# Altium project PLWD_Schematic.PrjPcb (part 1 of 2)
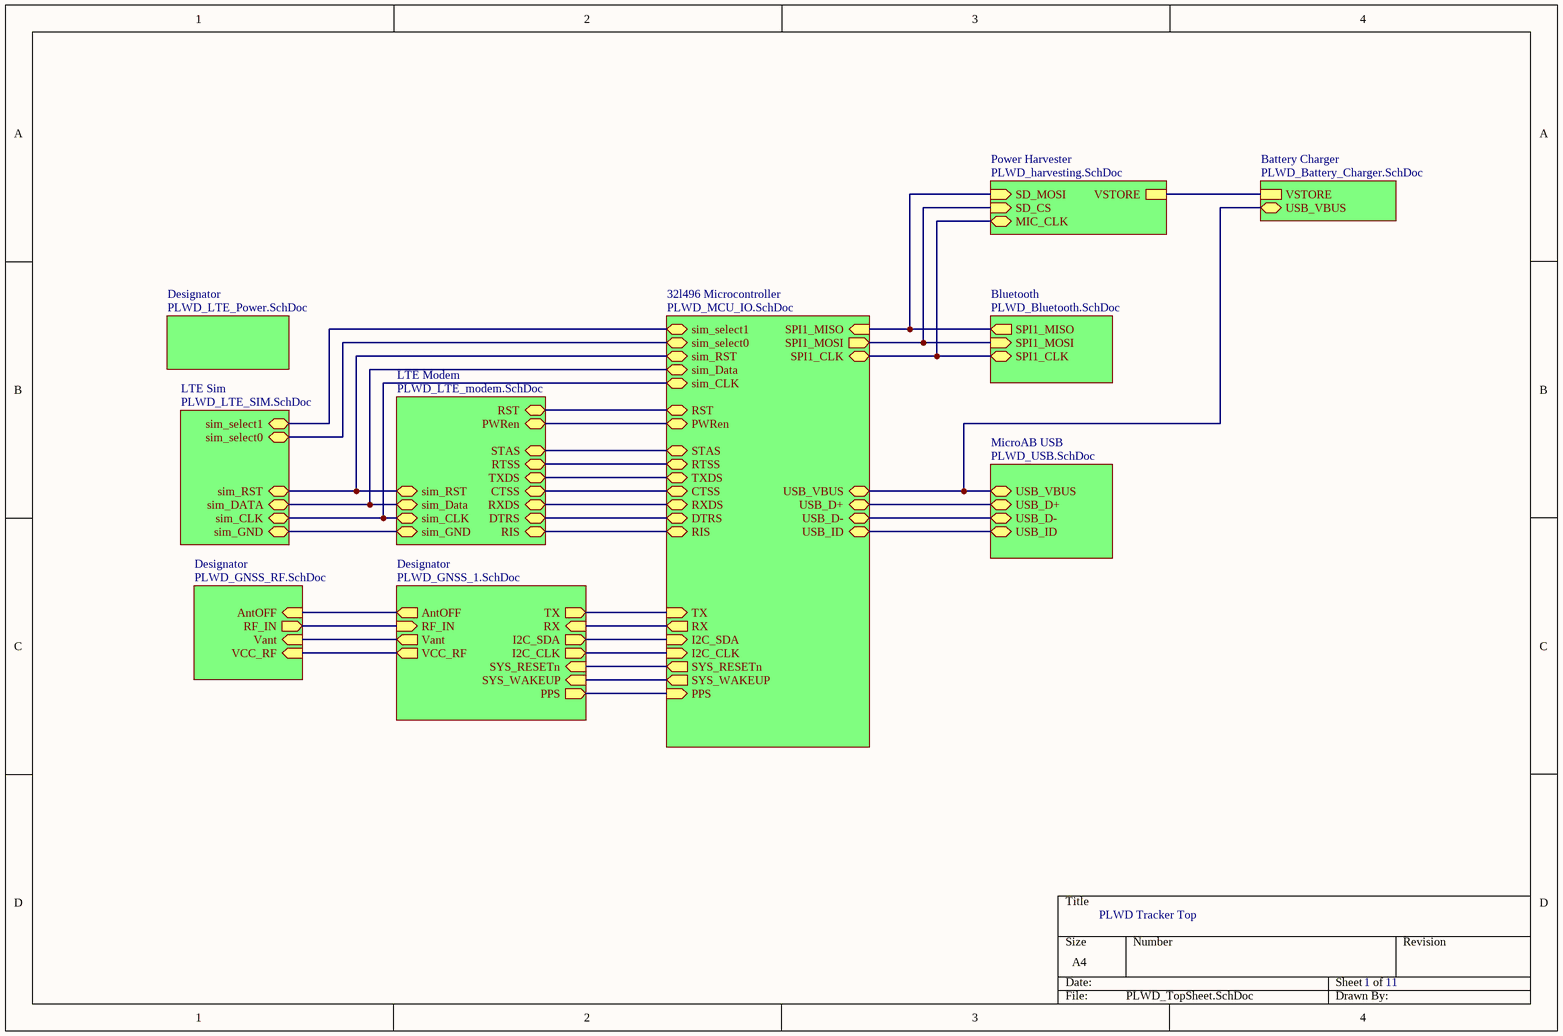
[diagram p0: PLWD_TopSheet.SchDoc]
11 sheets, 186 parts. Net scope: hierarchical (ports join the sheet entries above them; power ports are global).
Sheets:
  PLWD_TopSheet.SchDoc
    32l496 Microcontroller = PLWD_MCU_IO.SchDoc
    Bluetooth = PLWD_Bluetooth.SchDoc
    Designator = PLWD_GNSS_RF.SchDoc
    MicroAB USB = PLWD_USB.SchDoc
    Power Harvester = PLWD_harvesting.SchDoc
    Designator = PLWD_GNSS_1.SchDoc
    Battery Charger = PLWD_Battery_Charger.SchDoc
    LTE Modem = PLWD_LTE_modem.SchDoc
    Designator = PLWD_LTE_Power.SchDoc
    LTE Sim = PLWD_LTE_SIM.SchDoc

## Sheet PLWD_TopSheet.SchDoc
size A4; SheetNumber: 1; SheetTotal: 11

### Sub-sheets
32l496 Microcontroller = PLWD_MCU_IO.SchDoc: SPI1_MISO (in), SPI1_MOSI (out), USB_VBUS (bidir), USB_D+ (bidir), USB_D- (bidir), USB_ID (bidir), STAS (bidir), RTSS (bidir), TXDS (bidir), CTSS (bidir), RXDS (bidir), DTRS (bidir), RIS (bidir), PWRen (bidir), RST (bidir), sim_CLK (bidir), sim_Data (bidir), sim_RST (bidir), sim_select1 (bidir), sim_select0 (bidir), TX (in), RX (out), I2C_SDA (in), I2C_CLK (in), SYS_WAKEUP (out), PPS (in), SYS_RESETn (out), SPI1_CLK (bidir)
Battery Charger = PLWD_Battery_Charger.SchDoc: VSTORE, USB_VBUS (bidir)
Bluetooth = PLWD_Bluetooth.SchDoc: SPI1_MISO (out), SPI1_MOSI (in), SPI1_CLK (bidir)
Designator = PLWD_GNSS_RF.SchDoc: AntOFF (in), RF_IN (out), Vant (in), VCC_RF (in)
Designator = PLWD_GNSS_1.SchDoc: TX (out), RX (in), I2C_SDA (out), SYS_RESETn (in), I2C_CLK (out), SYS_WAKEUP (in), PPS (out), AntOFF (out), RF_IN (in), Vant (out), VCC_RF (out)
Designator = PLWD_LTE_Power.SchDoc: no entries
LTE Modem = PLWD_LTE_modem.SchDoc: sim_GND (bidir), sim_CLK (bidir), sim_Data (bidir), sim_RST (bidir), PWRen (bidir), RST (bidir), RIS (bidir), DTRS (bidir), RXDS (bidir), CTSS (bidir), TXDS (bidir), RTSS (bidir), STAS (bidir)
LTE Sim = PLWD_LTE_SIM.SchDoc: sim_GND (bidir), sim_DATA (bidir), sim_RST (bidir), sim_select0 (bidir), sim_CLK (bidir), sim_select1 (bidir)
MicroAB USB = PLWD_USB.SchDoc: USB_VBUS (bidir), USB_D+ (bidir), USB_D- (bidir), USB_ID (bidir)
Power Harvester = PLWD_harvesting.SchDoc: MIC_CLK (bidir), SD_MOSI (in), SD_CS (in), VSTORE

### Nets
Ant_In: sheet Designator/RF_IN, sheet Designator/RF_IN
AntOFF: sheet Designator/AntOFF, sheet Designator/AntOFF
CTSS: sheet 32l496 Microcontroller/CTSS, sheet LTE Modem/CTSS
DTRS: sheet 32l496 Microcontroller/DTRS, sheet LTE Modem/DTRS
PA6: sheet 32l496 Microcontroller/SPI1_MISO, sheet Bluetooth/SPI1_MISO, sheet Power Harvester/SD_MOSI
PA7: sheet 32l496 Microcontroller/SPI1_MOSI, sheet Bluetooth/SPI1_MOSI, sheet Power Harvester/SD_CS
PA9: sheet 32l496 Microcontroller/USB_VBUS, sheet MicroAB USB/USB_VBUS, sheet Battery Charger/USB_VBUS
PA10: sheet 32l496 Microcontroller/USB_D+, sheet MicroAB USB/USB_D+
PA11: sheet 32l496 Microcontroller/USB_D-, sheet MicroAB USB/USB_D-
PA12: sheet 32l496 Microcontroller/USB_ID, sheet MicroAB USB/USB_ID
PPS: sheet 32l496 Microcontroller/PPS, sheet Designator/PPS
PWRen: sheet 32l496 Microcontroller/PWRen, sheet LTE Modem/PWRen
RIS: sheet 32l496 Microcontroller/RIS, sheet LTE Modem/RIS
RST: sheet 32l496 Microcontroller/RST, sheet 32l496 Microcontroller/sim_RST, sheet LTE Modem/sim_RST, sheet LTE Modem/RST, sheet LTE Sim/sim_RST
RTSS: sheet 32l496 Microcontroller/RTSS, sheet LTE Modem/RTSS
RXDS: sheet 32l496 Microcontroller/RXDS, sheet LTE Modem/RXDS
sim_CLK: sheet 32l496 Microcontroller/sim_CLK, sheet LTE Modem/sim_CLK, sheet LTE Sim/sim_CLK
sim_Data: sheet 32l496 Microcontroller/sim_Data, sheet LTE Modem/sim_Data, sheet LTE Sim/sim_DATA
sim_GND: sheet LTE Modem/sim_GND, sheet LTE Sim/sim_GND
STAS: sheet 32l496 Microcontroller/STAS, sheet LTE Modem/STAS
SYS_RESETn: sheet 32l496 Microcontroller/SYS_RESETn, sheet Designator/SYS_RESETn
SYS_WAKEUP: sheet 32l496 Microcontroller/SYS_WAKEUP, sheet Designator/SYS_WAKEUP
TX: sheet 32l496 Microcontroller/TX, sheet Designator/TX
TXDS: sheet 32l496 Microcontroller/TXDS, sheet LTE Modem/TXDS
Vant: sheet Designator/Vant, sheet Designator/Vant
VCC_RF: sheet Designator/VCC_RF, sheet Designator/VCC_RF
NetR8_2: sheet 32l496 Microcontroller/SPI1_CLK, sheet Bluetooth/SPI1_CLK, sheet Power Harvester/MIC_CLK
NetR27_2: sheet 32l496 Microcontroller/sim_select1, sheet LTE Sim/sim_select1
NetR42_1: sheet Power Harvester/VSTORE, sheet Battery Charger/VSTORE
NetU1_36: sheet 32l496 Microcontroller/RX, sheet Designator/RX
NetU1_74: sheet 32l496 Microcontroller/sim_select0, sheet LTE Sim/sim_select0
NetU1_139: sheet 32l496 Microcontroller/I2C_CLK, sheet Designator/I2C_CLK
NetU1_140: sheet 32l496 Microcontroller/I2C_SDA, sheet Designator/I2C_SDA

### Notes on the sheet
- PLWD Tracker Top
- 1
- 11

## Sheet PLWD_MCU_IO.SchDoc
size A3; SheetNumber: 3; SheetTotal: 11
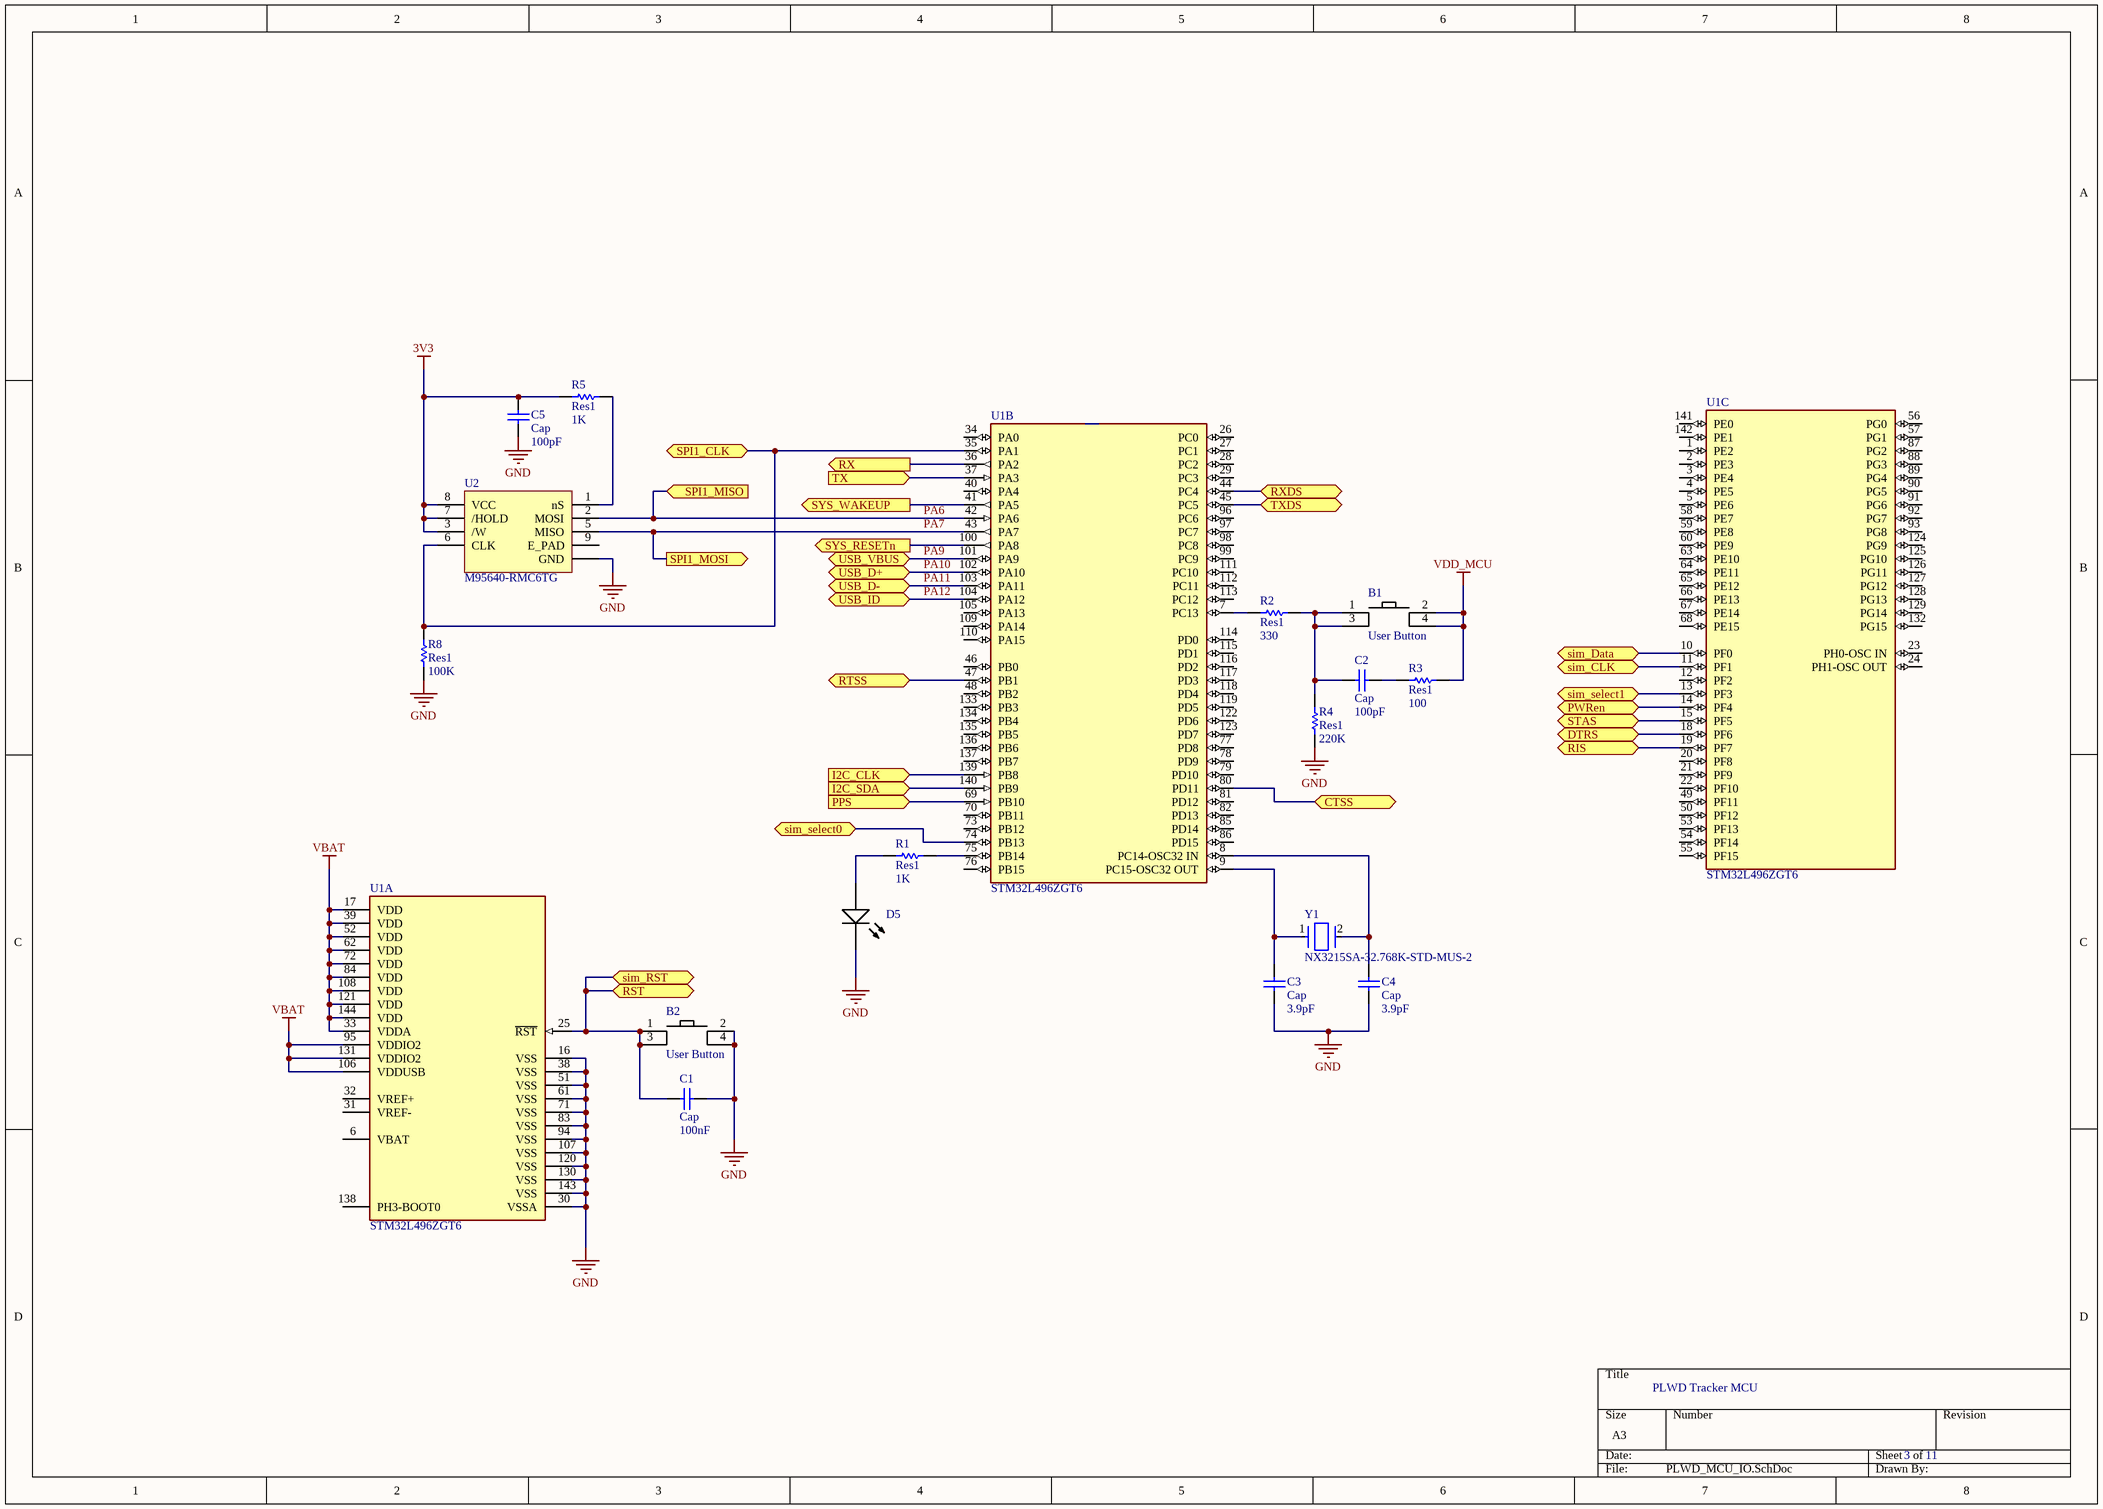
[diagram p1: PLWD_MCU_IO.SchDoc]

### Parts
B1  User Button
B2  User Button
C1  Cap  value 100nF  [RAD-0.3]
C2  Cap  value 100pF  [RAD-0.3]
C3  Cap  value 3.9pF  [RAD-0.3]
C4  Cap  value 3.9pF  [RAD-0.3]
C5  Cap  value 100pF  [RAD-0.3]
D5  16-219A/T2D-AR2T1QY/3T  [EVRL-0402-2_V]  (value not drawn)
R1  Res1  value 1K  [AXIAL-0.3]
R2  Res1  value 330  [AXIAL-0.3]
R3  Res1  value 100  [AXIAL-0.3]
R4  Res1  value 220K  [AXIAL-0.3]
R5  Res1  value 1K  [AXIAL-0.3]
R8  Res1  value 100K  [AXIAL-0.3]
U1  STM32L496ZGT6  [FP-LQFP144-1A-MFG]  (parts A,B,C of 3)
U2  M95640-RMC6TG
Y1  NX3215SA-32.768K-STD-MUS-2  [FP-NX3215SA-MFG]

### Ports
CTSS (bidir), DTRS (bidir), I2C_CLK (in), I2C_SDA (in), PPS (in), PWRen (bidir), RIS (bidir), RST (bidir), RTSS (bidir), RX (out), RXDS (bidir), sim_CLK (bidir), sim_Data (bidir), sim_RST (bidir), sim_select0 (bidir), sim_select1 (bidir), SPI1_CLK (bidir), SPI1_MISO (in), SPI1_MOSI (out), STAS (bidir), SYS_RESETn (out), SYS_WAKEUP (out), TX (in), TXDS (bidir), USB_D+ (bidir), USB_D- (bidir), USB_ID (bidir), USB_VBUS (bidir)

### Nets
3V3: C5.2 R5.1 U2.3(/W) U2.7(/HOLD) U2.8(VCC)
GND: B2.2 B2.4 C1.2 C3.1 C4.1 C5.1 D5.2(K) R4.1 R8.1 U1.16(VSS) U1.30(VSSA) U1.38(VSS) U1.51(VSS) U1.61(VSS) U1.71(VSS) U1.83(VSS) U1.94(VSS) U1.107(VSS) U1.120(VSS) U1.130(VSS) U1.143(VSS) U2.4(GND)
VBAT: U1.17(VDD) U1.33(VDDA) U1.39(VDD) U1.52(VDD) U1.62(VDD) U1.72(VDD) U1.84(VDD) U1.95(VDDIO2) U1.106(VDDUSB) U1.108(VDD) U1.121(VDD) U1.131(VDDIO2) U1.144(VDD)
VDD_MCU: B1.2 B1.4 R3.2
CTSS: U1.80(PD11) ; port CTSS
DTRS: U1.18(PF6) ; port DTRS
PA6: U1.42(PA6) U2.2(MOSI) ; port SPI1_MISO
PA7: U1.43(PA7) U2.5(MISO) ; port SPI1_MOSI
PA9: U1.101(PA9) ; port USB_VBUS
PA10: U1.102(PA10) ; port USB_D+
PA11: U1.103(PA11) ; port USB_D-
PA12: U1.104(PA12) ; port USB_ID
PPS: U1.69(PB10) ; port PPS
PWRen: U1.14(PF4) ; port PWRen
RIS: U1.19(PF7) ; port RIS
RST: B2.1 B2.3 C1.1 U1.25(~{RST}) ; port sim_RST, port RST
RTSS: U1.47(PB1) ; port RTSS
RXDS: U1.44(PC4) ; port RXDS
sim_CLK: U1.11(PF1) ; port sim_CLK
sim_Data: U1.10(PF0) ; port sim_Data
STAS: U1.15(PF5) ; port STAS
SYS_RESETn: U1.100(PA8) ; port SYS_RESETn
SYS_WAKEUP: U1.41(PA5) ; port SYS_WAKEUP
TX: U1.37(PA3) ; port TX
TXDS: U1.45(PC5) ; port TXDS
NetB1_1: B1.1 B1.3 C2.1 R2.2 R4.2
NetC2_2: C2.2 R3.1
NetC3_2: C3.2 U1.9(PC15-OSC32_OUT) Y1.1
NetC4_2: C4.2 U1.8(PC14-OSC32_IN) Y1.2
NetD5_1: D5.1(A) R1.1
NetR1_2: R1.2 U1.75(PB14)
NetR2_1: R2.1 U1.7(PC13)
NetR5_2: R5.2 U2.1(nS)
NetR8_2: R8.2 U1.35(PA1) U2.6(CLK) ; port SPI1_CLK
NetR27_2: U1.13(PF3) ; port sim_select1
NetU1_36: U1.36(PA2) ; port RX
NetU1_74: U1.74(PB13) ; port sim_select0
NetU1_139: U1.139(PB8) ; port I2C_CLK
NetU1_140: U1.140(PB9) ; port I2C_SDA

Not connected (* = marked no-connect by the designer): U1 1(PE2) 2(PE3) 3(PE4) 4(PE5) 5(PE6) 6(VBAT) 12(PF2) 20(PF8) 21(PF9) 22(PF10) 23(PH0-OSC_IN) 24(PH1-OSC_OUT) 26(PC0) 27(PC1) 28(PC2) 29(PC3) 31(VREF-) 32(VREF+) 34(PA0) 40(PA4) 46(PB0) 48(PB2) 49(PF11) 50(PF12) 53(PF13) 54(PF14) 55(PF15) 56(PG0) 57(PG1) 58(PE7) 59(PE8) 60(PE9) 63(PE10) 64(PE11) 65(PE12) 66(PE13) 67(PE14) 68(PE15) 70(PB11) 73(PB12) 76(PB15) 77(PD8) 78(PD9) 79(PD10) 81(PD12) 82(PD13) 85(PD14) 86(PD15) 87(PG2) 88(PG3) 89(PG4) 90(PG5) 91(PG6) 92(PG7) 93(PG8) 96(PC6) 97(PC7) 98(PC8) 99(PC9) 105(PA13) 109(PA14) 110(PA15) 111(PC10) 112(PC11) 113(PC12) 114(PD0) 115(PD1) 116(PD2) 117(PD3) 118(PD4) 119(PD5) 122(PD6) 123(PD7) 124(PG9) 125(PG10) 126(PG11) 127(PG12) 128(PG13) 129(PG14) 132(PG15) 133(PB3) 134(PB4) 135(PB5) 136(PB6) 137(PB7) 138(PH3-BOOT0) 141(PE0) 142(PE1); U2 9(E_PAD)

### Notes on the sheet
- PLWD Tracker MCU
- 3
- 11

### Library data of the parts
B1 B2 = button
C1-C5 = Cap: Capacitor; Published: 8-Jun-2000; LatestRevisionDate: 17-Jul-2002; LatestRevisionNote: Re-released for DXP Platform.; PackageReference: RAD-0.3; Publisher: Altium Limited; PackageDescription: Radial Cap, Thru-Hole; 2 Leads; 0.3 in Pin Spacing
D5 = CMP-007-00000-2: Chip LED, White, 5 V, 10 mA, 30 mW, -40 to 85 degC, 2-Pin SMD (0402), RoHS, Tape and Reel; Manufacturer: Everlight Electronics; Luminous Intensity: 360mcd; Forward Voltage: 2.6V; Viewing Angle: 130degrees; Power: 30mW; Forward Current: 5mA; Package Quantity: 3000; Max Operating Temperature: 85°C; Datasheet Version: Rev. 5, 04/2013; Datasheet URL: http://www.everlight.com/file/ProductFile/16-219A-T2D-AR2T1QY-3T.pdf; Package Reference: 0402; Mounting Technology: SM; Case/Package: 0402; Illumination Colour: White; Manufacturer URL: http://www.everlight.com/; Package Description: 2-Pin Surface Mount Device, Body 1 x 0.5 mm; RoHS Compliant: True; Packaging: TapeandReel; Min Operating Temperature: -40°C
R1-R5 R8 = Res1: Resistor; Published: 8-Jun-2000; LatestRevisionDate: 17-Jul-2002; LatestRevisionNote: Re-released for DXP Platform.; PackageReference: AXIAL-0.3; Publisher: Altium Limited; PackageDescription: Axial Device, Thru-Hole; 2 Leads; 0.3 in Pin Spacing
U1 = CMP-12105-000038-1: IC MCU 32BIT 1MB FLASH 144LQFP; Manufacturer: STMicroelectronics; Max Supply Voltage: 3.6V; Core Architecture: ARM Cortex-M4; Data Bus Width: 32bits; Number Of I2C Channels: 4; Standoff Height: 0.05mm; Max Junction Temp: +105°C; Number Of I/Os: 115; Number Of Pwm Channels: 28; Number Of Spi Channels: 3; Min Supply Voltage: 1.05V; Number Of Adc Channels: 24; Interface: I2C,SPI,UART,USART,CAN,USB,LIN,IrDA,I2S,Other; Number Of Timers/Counters: 13; Ram Size: 320KBytes; Frequency: 80MHz; Number Of Usb Channels: 1; Number Of Uart Channels: 6; Memory Size: 1MBytes; Temperature: -40°C to +105°C; Category: IC; ComponentLink2URL: https://www.st.com/resource/en/datasheet/stm32l496zg.pdf; Device Class L2: Embedded Processors and Controllers; Automotive: No; Device Class L3: Microcontrollers; Digikey Description: IC MCU 32BIT 1MB FLASH 144LQFP; Device Class L1: Integrated Circuits (ICs); Ambient Temperature Range High: +85°C; Ambient Temperature Range Low: -40°C; Temperature Range Low: -40°C; ComponentLink2Description: Datasheet; Package: LQFP144-1A; Manufacturer Part Number: STM32L496ZGT6; Octopart: https://octopart.com/stm32l496zgt6-stmicroelectronics-80927210; Number Of Cores: 1; Height: 1.6mm; Memory Type: FLASH; Lead Free: Yes; Temperature Range High: +105°C; RoHS: TRUE; Number Of A/D Converters: 3; Ipc Land Pattern Name: QFP50P2200X2200X160-144
U2 = M95640-RMC6TG: M95640 Series 64 Kb (8K x 8) 5.5 V 20 MHz SMT Serial SPI bus EEPROM - UFDFPN-8; Manufacturer: STMicroelectronics; Density: 64Kb; Frequency: 20MHz; Interface: SPI,Serial,3-WIRE; Max Supply Voltage: 5.5V; Min Supply Voltage: 1.8V; Nominal Supply Current: 5mA; Access Time: 20ns; Organization: 8KX8; Write Protection: YES; Supplier 1: Digi-Key; Manufacturer Part Number: M95640-RMC6TG; RoHS: Yes; Category: EEPROM; Pricing 1: 1=0.54000, 10=0.53100, 25=0.49240, 50=0.49000, 100=0.43510, 250=0.42956, 500=0.42306, 1000=0.41176 (USD); Mount: Surface Mount; Number of Pins: 8; Min Operating Temperature: -40°C; Max Operating Temperature: 85°C; Packaging: Tape and Reel; Memory Type: EEPROM; Package Quantity: 5000; Access Time-Max: 20ns; Supply Current: 5mA; Max Frequency: 20MHz; Series: -; Programming Voltage: 5.5V; Radiation Hardening: No; RoHS Compliant: Yes; Lead Free: Lead Free; ComponentLink1URL: https://datasheet.ciiva.com/1912/cd00258834-1912079.pdf?src-supplier=Digi-Key; ComponentLink1Description: https://datasheet.ciiva.com/1912/cd00258834-1912079.pdf?src-supplier=Digi-Key; ComponentLink2URL: https://datasheet.ciiva.com/26910/getdatasheetpartid-755070-26910586.pdf?src-supplier=Verical; ComponentLink2Description: https://datasheet.ciiva.com/26910/getdatasheetpartid-755070-26910586.pdf?src-supplier=Verical; ComponentLink3URL: https://datasheet.ciiva.com/16622/cd00258834-16622988.pdf?src-supplier=Avnet+Europe; ComponentLink3Description: https://datasheet.ciiva.com/16622/cd00258834-16622988.pdf?src-supplier=Avnet+Europe; Supplier Part Number 1: 497-15780-1-ND
Y1 = CMP-200220-000010-1: CRYSTAL 32.7680KHZ 12.5PF SMD; Frequency Tolerance: 20ppm; ESR (Equivalent Series Resistance): 70kR; Frequency: 32.768kHz; Length: 0.126inch; Number of Pins: 2; Max Operating Temperature: 125°C; Width: 0.059inch; Load Capacitance: 12.5pF; Case/Package: SMD/SMT; Height: 0.035inch; Packaging: Tape and Reel; Mount: Surface Mount; Package Quantity: 1000; Min Operating Temperature: -40°C

## Sheet PLWD_Bluetooth.SchDoc
size A4; SheetNumber: 2; SheetTotal: 11
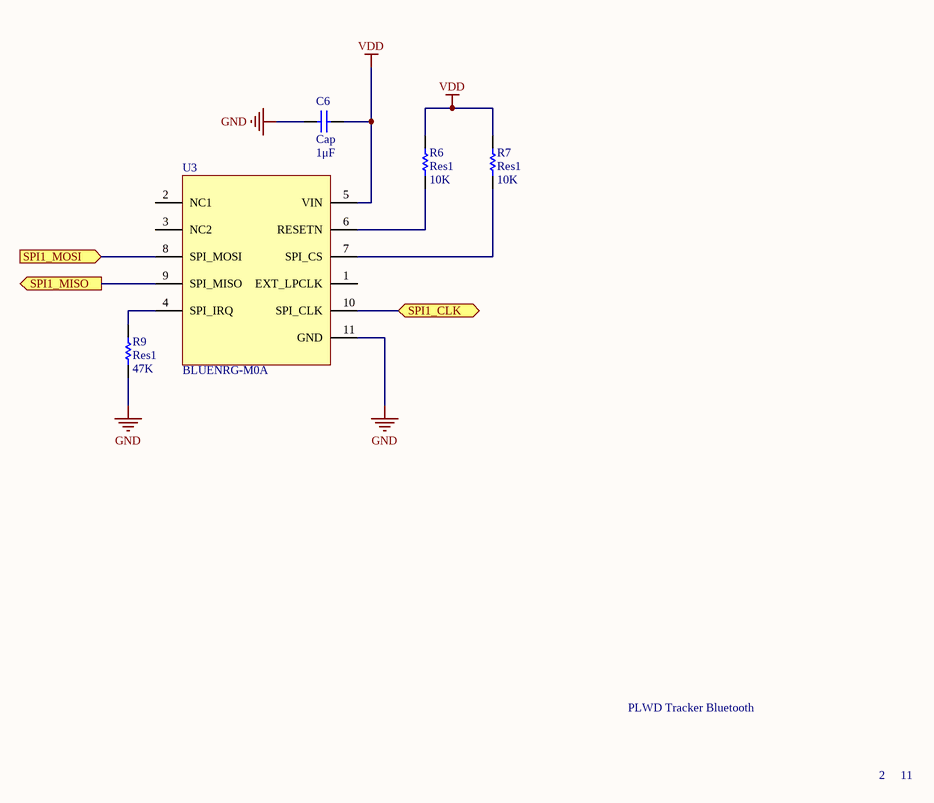
[diagram p2: PLWD_Bluetooth.SchDoc]

### Parts
C6  Cap  value 1μF  [RAD-0.3]
R6  Res1  value 10K  [AXIAL-0.3]
R7  Res1  value 10K  [AXIAL-0.3]
R9  Res1  value 47K  [AXIAL-0.3]
U3  BLUENRG-M0A

### Ports
SPI1_CLK (bidir), SPI1_MISO (out), SPI1_MOSI (in)

### Nets
GND: C6.1 R9.1 U3.11(GND)
VDD: C6.2 R6.2 R7.2 U3.5(VIN)
PA6: U3.9(SPI_MISO) ; port SPI1_MISO
PA7: U3.8(SPI_MOSI) ; port SPI1_MOSI
NetR6_1: R6.1 U3.6(RESETN)
NetR7_1: R7.1 U3.7(SPI_CS)
NetR8_2: U3.10(SPI_CLK) ; port SPI1_CLK
NetR9_2: R9.2 U3.4(SPI_IRQ)

Not connected (* = marked no-connect by the designer): U3 1(EXT_LPCLK) 2(NC1) 3(NC2)

### Notes on the sheet
- PLWD Tracker Bluetooth
- 2
- 11

### Library data of the parts
C6 = Cap: Capacitor; Published: 8-Jun-2000; LatestRevisionDate: 17-Jul-2002; LatestRevisionNote: Re-released for DXP Platform.; PackageReference: RAD-0.3; Publisher: Altium Limited; PackageDescription: Radial Cap, Thru-Hole; 2 Leads; 0.3 in Pin Spacing
R6 R7 R9 = Res1: Resistor; Published: 8-Jun-2000; LatestRevisionDate: 17-Jul-2002; LatestRevisionNote: Re-released for DXP Platform.; PackageReference: AXIAL-0.3; Publisher: Altium Limited; PackageDescription: Axial Device, Thru-Hole; 2 Leads; 0.3 in Pin Spacing
U3 = BLUENRG-M0A: Very low power network processor module for Bluetooth® low energy v4.2; Manufacturer: STMicroelectronics; Supplier 1: Digi-Key; Manufacturer Part Number: BLUENRG-M0A; RoHS: Yes; Category: RF Receivers, Transceivers; Pricing 1: 1=12.60000, 10=11.54700, 25=10.49720, 100=9.44740, 250=8.66008, 500=8.34996 (USD); RoHS Compliant: Yes; Supplier Part Number 1: 497-BLUENRG-M0ACT-ND

## Sheet PLWD_GNSS_RF.SchDoc
size A3; SheetNumber: 4; SheetTotal: 11
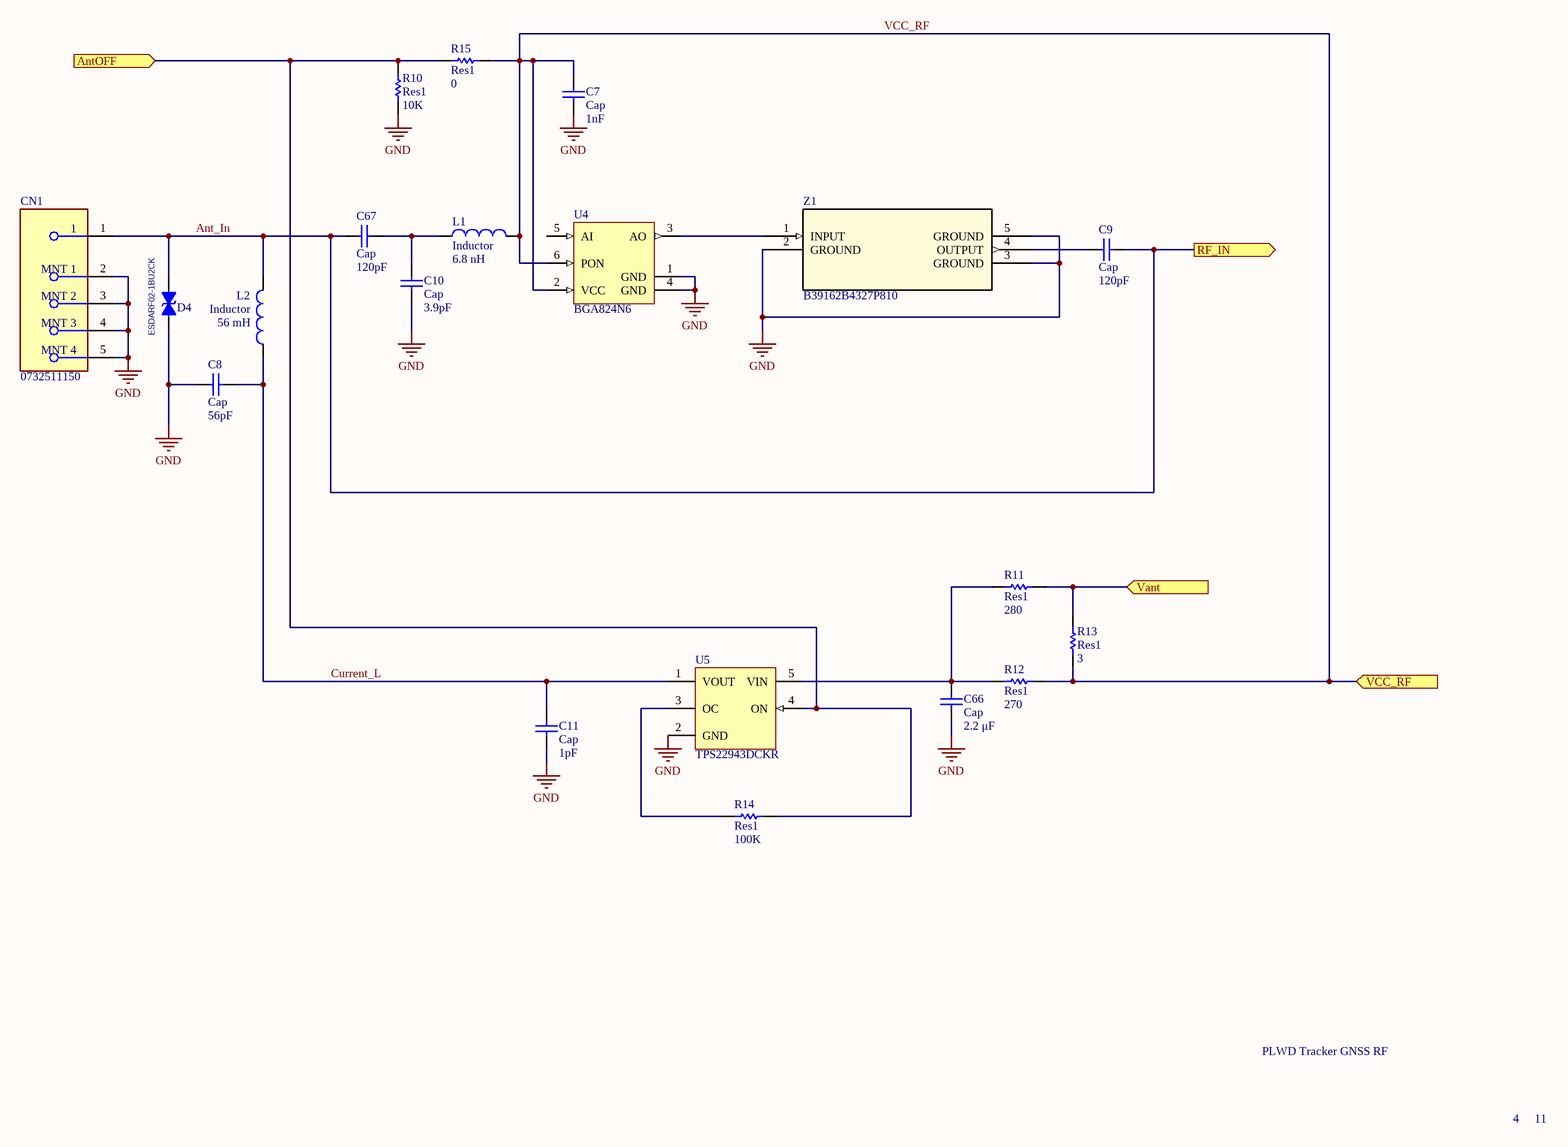
[diagram p3: PLWD_GNSS_RF.SchDoc]

### Parts
C7  Cap  value 1nF  [RAD-0.3]
C8  Cap  value 56pF  [RAD-0.3]
C9  Cap  value 120pF  [RAD-0.3]
C10  Cap  value 3.9pF  [RAD-0.3]
C11  Cap  value 1pF  [RAD-0.3]
C66  Cap  value 2.2 μF  [RAD-0.3]
C67  Cap  value 120pF  [RAD-0.3]
CN1  0732511150  [FP-0732511150-MFG]
D4  ESDARF02-1BU2CK  [ST_0201B]
L1  Inductor  value 6.8 nH  [0402-A]
L2  Inductor  value 56 mH  [0402-A]
R10  Res1  value 10K  [AXIAL-0.3]
R11  Res1  value 280  [AXIAL-0.3]
R12  Res1  value 270  [AXIAL-0.3]
R13  Res1  value 3  [AXIAL-0.3]
R14  Res1  value 100K  [AXIAL-0.3]
R15  Res1  value 0  [AXIAL-0.3]
U4  BGA824N6  [INF-TSNP-6-2_V]
U5  TPS22943DCKR  [DCK0005A_N]
Z1  B39162B4327P810  [B39162B4327P810_TDK]

### Ports
AntOFF (in), RF_IN (out), Vant (in), VCC_RF (in)

### Nets
GND: C7.1 C8.1 C10.1 C11.1 C66.1 CN1.2(MNT_1) CN1.3(MNT_2) CN1.4(MNT_3) CN1.5(MNT_4) D4.1 R10.1 U4.1(GND) U4.4(GND) U5.2(GND) Z1.2(GROUND) Z1.3(GROUND) Z1.5(GROUND)
Ant_In: C9.2 C67.1 CN1.1 D4.2 L2.2 ; port RF_IN
AntOFF: R10.2 R14.2 R15.1 U5.4(ON) ; port AntOFF
Current_L: C8.2 C11.2 L2.1 U5.1(VOUT)
Vant: R11.2 R13.2 ; port Vant
VCC_RF: C7.2 L1.2 R12.2 R13.1 R15.2 U4.2(VCC) U4.6(PON) ; port VCC_RF
NetC9_1: C9.1 Z1.4(OUTPUT)
NetC10_2: C10.2 C67.2 L1.1
NetC66_2: C66.2 R11.1 R12.1 U5.5(VIN)
NetR14_1: R14.1 U5.3(OC)
NetU4_3: U4.3(AO) Z1.1(INPUT)

Not connected (* = marked no-connect by the designer): U4 5(AI)

### Notes on the sheet
- PLWD Tracker GNSS RF
- 4
- 11

### Library data of the parts
C7-C11 C66 C67 = Cap: Capacitor; Published: 8-Jun-2000; LatestRevisionDate: 17-Jul-2002; LatestRevisionNote: Re-released for DXP Platform.; PackageReference: RAD-0.3; Publisher: Altium Limited; PackageDescription: Radial Cap, Thru-Hole; 2 Leads; 0.3 in Pin Spacing
CN1 = CMP-04764-000001-1: CONN SMA RCPT STR 50OHM EDGE MNT; Manufacturer: Molex Inc; Voltage Rating: 500V; Is Female: yes; Impedance: 50Ω; Conn Orientation: Horizontal; Dielectric Material: PTFE; Frequency: 18GHz; Shielding: true; Number Of Contacts: 1; Temperature: -65°C to +165°C; Device Class L2: RF / Coaxial Connectors; Contact Material: Gold,Nickel; RoHS: TRUE; ComponentLink2Description: Datasheet; Digikey Description: CONN SMA RCPT STR 50OHM EDGE MNT; Category: Conn; Package: 0; Device Class L1: Connectors; Manufacturer Part Number: 0732511150; Temperature Range High: +165°C; Mouser Description: RF Connectors / Coaxial Connectors SMA ST PCB-JCK STD EMT; Footprint Url: https://www.molex.com/pdm_docs/sd/732511150_sd.pdf; Octopart: https://octopart.com/73251-1150-molex-777272; Automotive: No; Lead Free: Yes; Temperature Range Low: -65°C; ComponentLink2URL: https://www.molex.com/webdocs/datasheets/pdf/en-us/0732511150_RF_COAX_CONNECTORS.pdf; Device Class L3: unset
L1 L2 = Inductor: Code_IEC: 1005; Published: 8-Jun-2000; LatestRevisionDate: 29-May-2009; LatestRevisionNote: IPC-7351 Footprint Added.; PackageReference: 0402-A; Publisher: Altium Limited; PackageDescription: Chip Inductor; Code_JEITA: 0402
R10-R15 = Res1: Resistor; Published: 8-Jun-2000; LatestRevisionDate: 17-Jul-2002; LatestRevisionNote: Re-released for DXP Platform.; PackageReference: AXIAL-0.3; Publisher: Altium Limited; PackageDescription: Axial Device, Thru-Hole; 2 Leads; 0.3 in Pin Spacing
U4 = CMP-1210-00004-1: Silicon Germanium Low Noise Amplifier for Global Navigation Satellite Systems (GNSS), -40 to 85 degC, TSNP-6, Reel, Green; Manufacturer: Infineon; P-1dB (in): -6; F (typ): 0.55Â dB; Green: TRUE; I (typ): 3.9Â mA; Frequency: 1550 to 1615 MHz; Gain (typ): 17Â dB; Halogen-free: TRUE; ComponentLink2Description: Datasheet; ComponentLink1URL: http://www.infineon.com/; PartNumber: BGA824N6; PackageVersion: Jan-13; PackageReference: TSNP-6-2; Packing: Reel; ComponentLink3URL: http://www.infineon.com/dgdl/TSNP-6-2-Package_Overview.pdf?folderId=db3a304327b89750012805e1379a6124&fileId=db3a30433c6612b1013c6bcb02293ba1; PackageDescription: 6-Pin Thin Small Non Leaded Package, 1.1 x 0.7 mm Body, 0.4 mm Pitch; ComponentLink1Description: Manufacturer URL; ComponentLink2URL: http://www.infineon.com/dgdl/BGA824N6.pdf?folderId=db3a30431f848401011fcbf2ab4c04c4&fileId=db3a30433f764301013f7b53cdd02721; ComponentLink3Description: Package Specification; Mounting Technology: Surface Mount; DatasheetVersion: Rev. 3.0
U5 = CMP-0329-00079-2: Low-Input Voltage 40 mA Current Limited Load Switch, 400 mOhms rDS(On), -40 to 85 degC, 5-pin SC70 (DCK), Green (RoHS & no Sb/Br); Manufacturer: Texas Instruments; SubFamily: Current Limited Switch; Vin(Min)(V): 1.62; Number of FETs: 1; Adjustable Current Limit(Min)(A): 0.04; Enable/Shutdown: Active High; Vin(Max)(V): 5.5; rDS(on) per FET(Typ)(mOhms): 400; Iq(Typ)(uA): 40; PackageReference: DCK0005A; PackageDescription: 5-Pin Plastic Small-Outline Package, 2 x 1.3 mm Body, 0.65 mm Pitch, 2.1 mm Lead Span; DatasheetVersion: SLVS832C; ComponentLink1URL: http://www.ti.com/general/docs/lit/getliterature.tsp?genericPartNumber=TPS22943&fileType=pdf; Mounting Technology: Surface Mount; Code_JEDEC: MO-203-AA; PartNumber: TPS22943DCKR; PackageVersion: revG, Jan-2007; Eco-Plan: Green (RoHS & no Sb/Br); ComponentLink1Description: Datasheet
Z1 = B39162B4327P810: No Description Available; Mfr_Name: TDK; Copyright: Copyright (C) 2022 Ultra Librarian. All rights reserved.; Manufacturer_Part_Number: B39162B4327P810; RefDes: RefDes; Type: DEV

## Sheet PLWD_USB.SchDoc
size A4; SheetNumber: 11; SheetTotal: 11
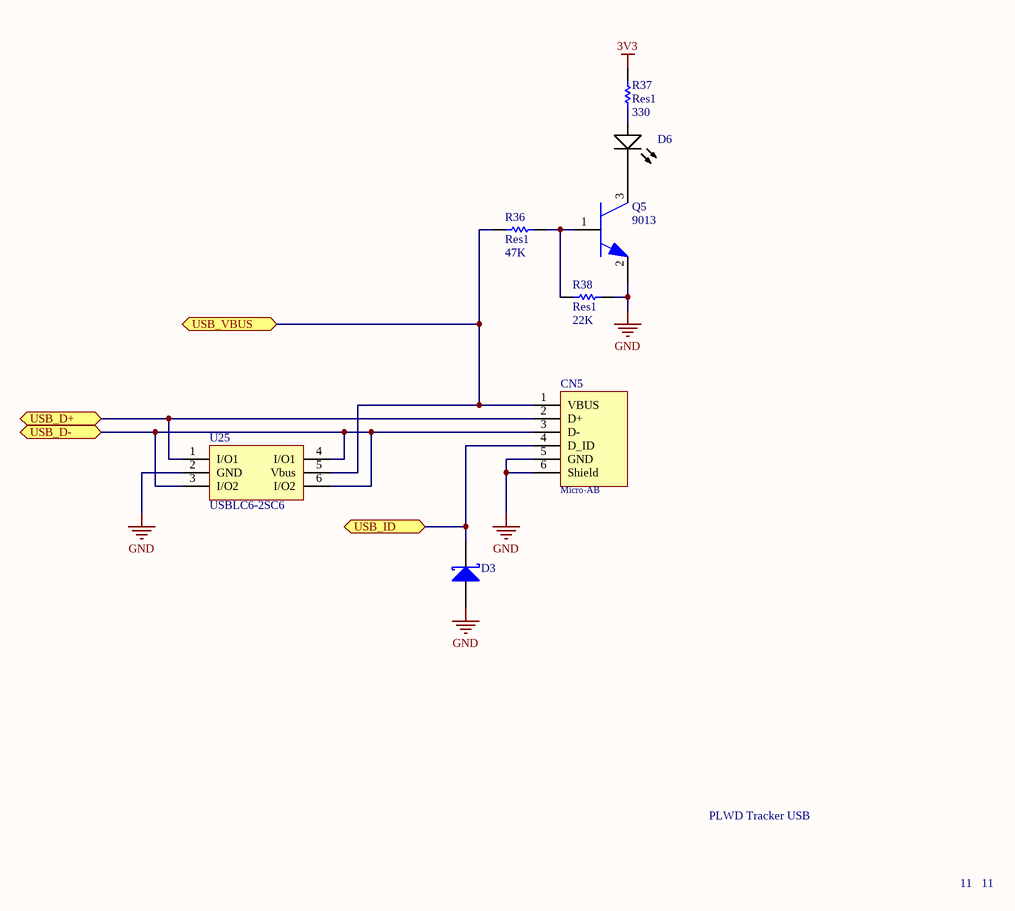
[diagram p4: PLWD_USB.SchDoc]

### Parts
CN5  Micro-AB
D3  D Schottky  [SMB]  (value not drawn)
D6  16-219A/T2D-AR2T1QY/3T  [EVRL-0402-2_V]  (value not drawn)
Q5  9013
R36  Res1  value 47K  [AXIAL-0.3]
R37  Res1  value 330  [AXIAL-0.3]
R38  Res1  value 22K  [AXIAL-0.3]
U25  USBLC6-2SC6

### Ports
USB_D+ (bidir), USB_D- (bidir), USB_ID (bidir), USB_VBUS (bidir)

### Nets
3V3: R37.2
GND: CN5.5(GND) CN5.6(Shield) D3.1(A) Q5.2 R38.2 U25.2(GND)
PA9: CN5.1(VBUS) R36.1 U25.5(Vbus) ; port USB_VBUS
PA10: CN5.2(D+) U25.1(I/O1) ; port USB_D+
PA11: CN5.3(D-) U25.3(I/O2) U25.4(I/O1) U25.6(I/O2) ; port USB_D-
PA12: CN5.4(D_ID) D3.2(K) ; port USB_ID
NetD6_1: D6.1(A) R37.1
NetD6_2: D6.2(K) Q5.3
NetQ5_1: Q5.1 R36.2 R38.1

### Notes on the sheet
- PLWD Tracker USB
- 11

### Library data of the parts
CN5 = USB Micro-AB 0475891001: Conn Micro USB 2.0 Type AB RCP 5 POS 0.65mm Solder RA SMD 5 Terminal 1 Port Micro-USB T/R; Manufacturer: Molex; Number of Terminals/Pins: 5; Gender: Receptacle; Number of Ports: 1; Max Voltage Rating (AC): 30V; Supplier 1: Digi-Key; Manufacturer Part Number: 0475891001; RoHS: Yes; Category: USB Connectors; Stock 1: 950; Pricing 1: 1=1.07000, 10=0.88200, 100=0.73520 (USD); Mount: Surface Mount,Horizontal; Contact Material: Copper Alloy; Contact Plating: Gold; Housing Material: Thermoplastic; Min Operating Temperature: -30°C; Max Operating Temperature: 85°C; Termination: Solder; Orientation: Right Angle; Packaging: Tape and Reel; Package Quantity: 10500; Connector Type: USB; Number of Contacts: 5; Features: Shielded; Pitch: 0.65mm; Depth: 5.6mm; RoHS Compliant: Yes; ComponentLink1URL: https://datasheet.ciiva.com/29660/475891001-sd-29660109.pdf?src-supplier=Digi-Key; ComponentLink1Description: https://datasheet.ciiva.com/29660/475891001-sd-29660109.pdf?src-supplier=Digi-Key; Supplier Part Number 1: WM14335CT-ND
D3 = D Schottky: Schottky Diode; Published: 8-Jun-2000; LatestRevisionDate: 17-Jul-2002; LatestRevisionNote: Re-released for DXP Platform.; PackageReference: SMB; Publisher: Altium Limited; PackageDescription: DO-214-AA/SMB; 2 C-Bend Leads; Body 5.3 x 3.6 mm, inc. leads (LxW); Code_JEDEC: DO-214-AA
D6 = CMP-007-00000-2: as D5 on sheet PLWD_MCU_IO; Package Quantity: 3000; Max Operating Temperature: 85°C; Datasheet Version: Rev. 5, 04/2013; Datasheet URL: http://www.everlight.com/file/ProductFile/16-219A-T2D-AR2T1QY-3T.pdf; Package Reference: 0402; Mounting Technology: SM; Case/Package: 0402; Illumination Colour: White; Manufacturer URL: http://www.everlight.com/; Package Description: 2-Pin Surface Mount Device, Body 1 x 0.5 mm; RoHS Compliant: True; Packaging: TapeandReel; Min Operating Temperature: -40°C
Q5 = MMBT9013: Collector Base Voltage: 40 V; Collector Emitter Voltage: 30 V; Emitter Base Voltage: 5 V; Collector Current: 500 mA; Power Dissiapation: 200 mW
R36-R38 = Res1: Resistor; Published: 8-Jun-2000; LatestRevisionDate: 17-Jul-2002; LatestRevisionNote: Re-released for DXP Platform.; PackageReference: AXIAL-0.3; Publisher: Altium Limited; PackageDescription: Axial Device, Thru-Hole; 2 Leads; 0.3 in Pin Spacing
U25 = USBLC6-2SC6: USBLC6 Series 2 Line 6 V Uni / Bi-Directional ESD Protection - SOT-23-6; Manufacturer: STMicroelectronics; Direction: Unidirectional,Bidirectional; Capacitance: 3.5pF; Clamping Voltage: 17V; Operating Supply Voltage: 1.1V; Number of Channels: 2; Breakdown Voltage: 6V; Reverse Standoff Voltage: 5.25V; Power Line Protection: Yes; Test Current: 1mA; Max Reverse Leakage Current: 150nA; Peak Pulse Current: 5A; Element Configuration: Dual; Data Rate: 480Mbps; Number of Elements: 1; Working Voltage: 5V; Supplier 1: Avnet; Manufacturer Part Number: USBLC6-2SC6; RoHS: Yes; Category: TVS Diodes; Stock 1: 1010; Pricing 1: 1=0.48700, 10=0.42400, 25=0.38400, 50=0.34500, 100=0.30500 (USD); Mount: Surface Mount; Case/Package: SOT-23; Number of Pins: 6; Contact Plating: Tin,Matte; Min Operating Temperature: -40°C; Max Operating Temperature: 125°C; Packaging: Tape and Reel; Package Quantity: 3000; Termination: SMD/SMT; Number of Bidirectional Channels: 2; Min Breakdown Voltage: 6V; ESD Protection: Yes; Leakage Current: 150nA; Series: USB; Reverse Breakdown Voltage: 6V; Polarity: Unidirectional,Bidirectional; Max Breakdown Voltage: 6V; Clamping Voltage-Max: 17V; Length: 3.05mm; Width: 1.75mm; Height: 1.3mm; Depth: 1.75mm; Radiation Hardening: No; REACH SVHC: No SVHC; Lead Free: Lead Free; RoHS Compliant: Yes; ComponentLink1URL: https://datasheet.ciiva.com/1268/1690354-1268384.pdf?src-supplier=Element14; ComponentLink1Description: https://datasheet.ciiva.com/1268/1690354-1268384.pdf?src-supplier=Element14; ComponentLink2URL: https://datasheet.ciiva.com/4508/cd00050750-113117-4508433.pdf?src-supplier=Mouser; ComponentLink2Description: https://datasheet.ciiva.com/4508/cd00050750-113117-4508433.pdf?src-supplier=Mouser; ComponentLink3URL: https://datasheet.ciiva.com/15143/getdatasheetpartid-148465-15143789.pdf?src-supplier=Verical; ComponentLink3Description: https://datasheet.ciiva.com/15143/getdatasheetpartid-148465-15143789.pdf?src-supplier=Verical; ComponentLink4URL: https://datasheet.ciiva.com/26787/usblc6-2sc6-26787908.pdf?src-supplier=IIIC; ComponentLink4Description: https://datasheet.ciiva.com/26787/usblc6-2sc6-26787908.pdf?src-supplier=IIIC; ComponentLink5URL: https://datasheet.ciiva.com/16200/cd00050750-16200026.pdf?src-supplier=Future+Electronics; ComponentLink5Description: https://datasheet.ciiva.com/16200/cd00050750-16200026.pdf?src-supplier=Future+Electronics; ComponentLink6URL: https://datasheet.ciiva.com/41444/001184109-da-01-en-ic-esd-protecti-usblc6-2sc6-sot-23-6-stm-41444156.pdf?src-supplier=Conrad; ComponentLink6Description: https://datasheet.ciiva.com/41444/001184109-da-01-en-ic-esd-protecti-usblc6-2sc6-sot-23-6-stm-41444156.pdf?src-supplier=Conrad; Supplier Part Number 1: 26M4748

## Sheet PLWD_harvesting.SchDoc
size B; SheetNumber: 10; SheetTotal: 11
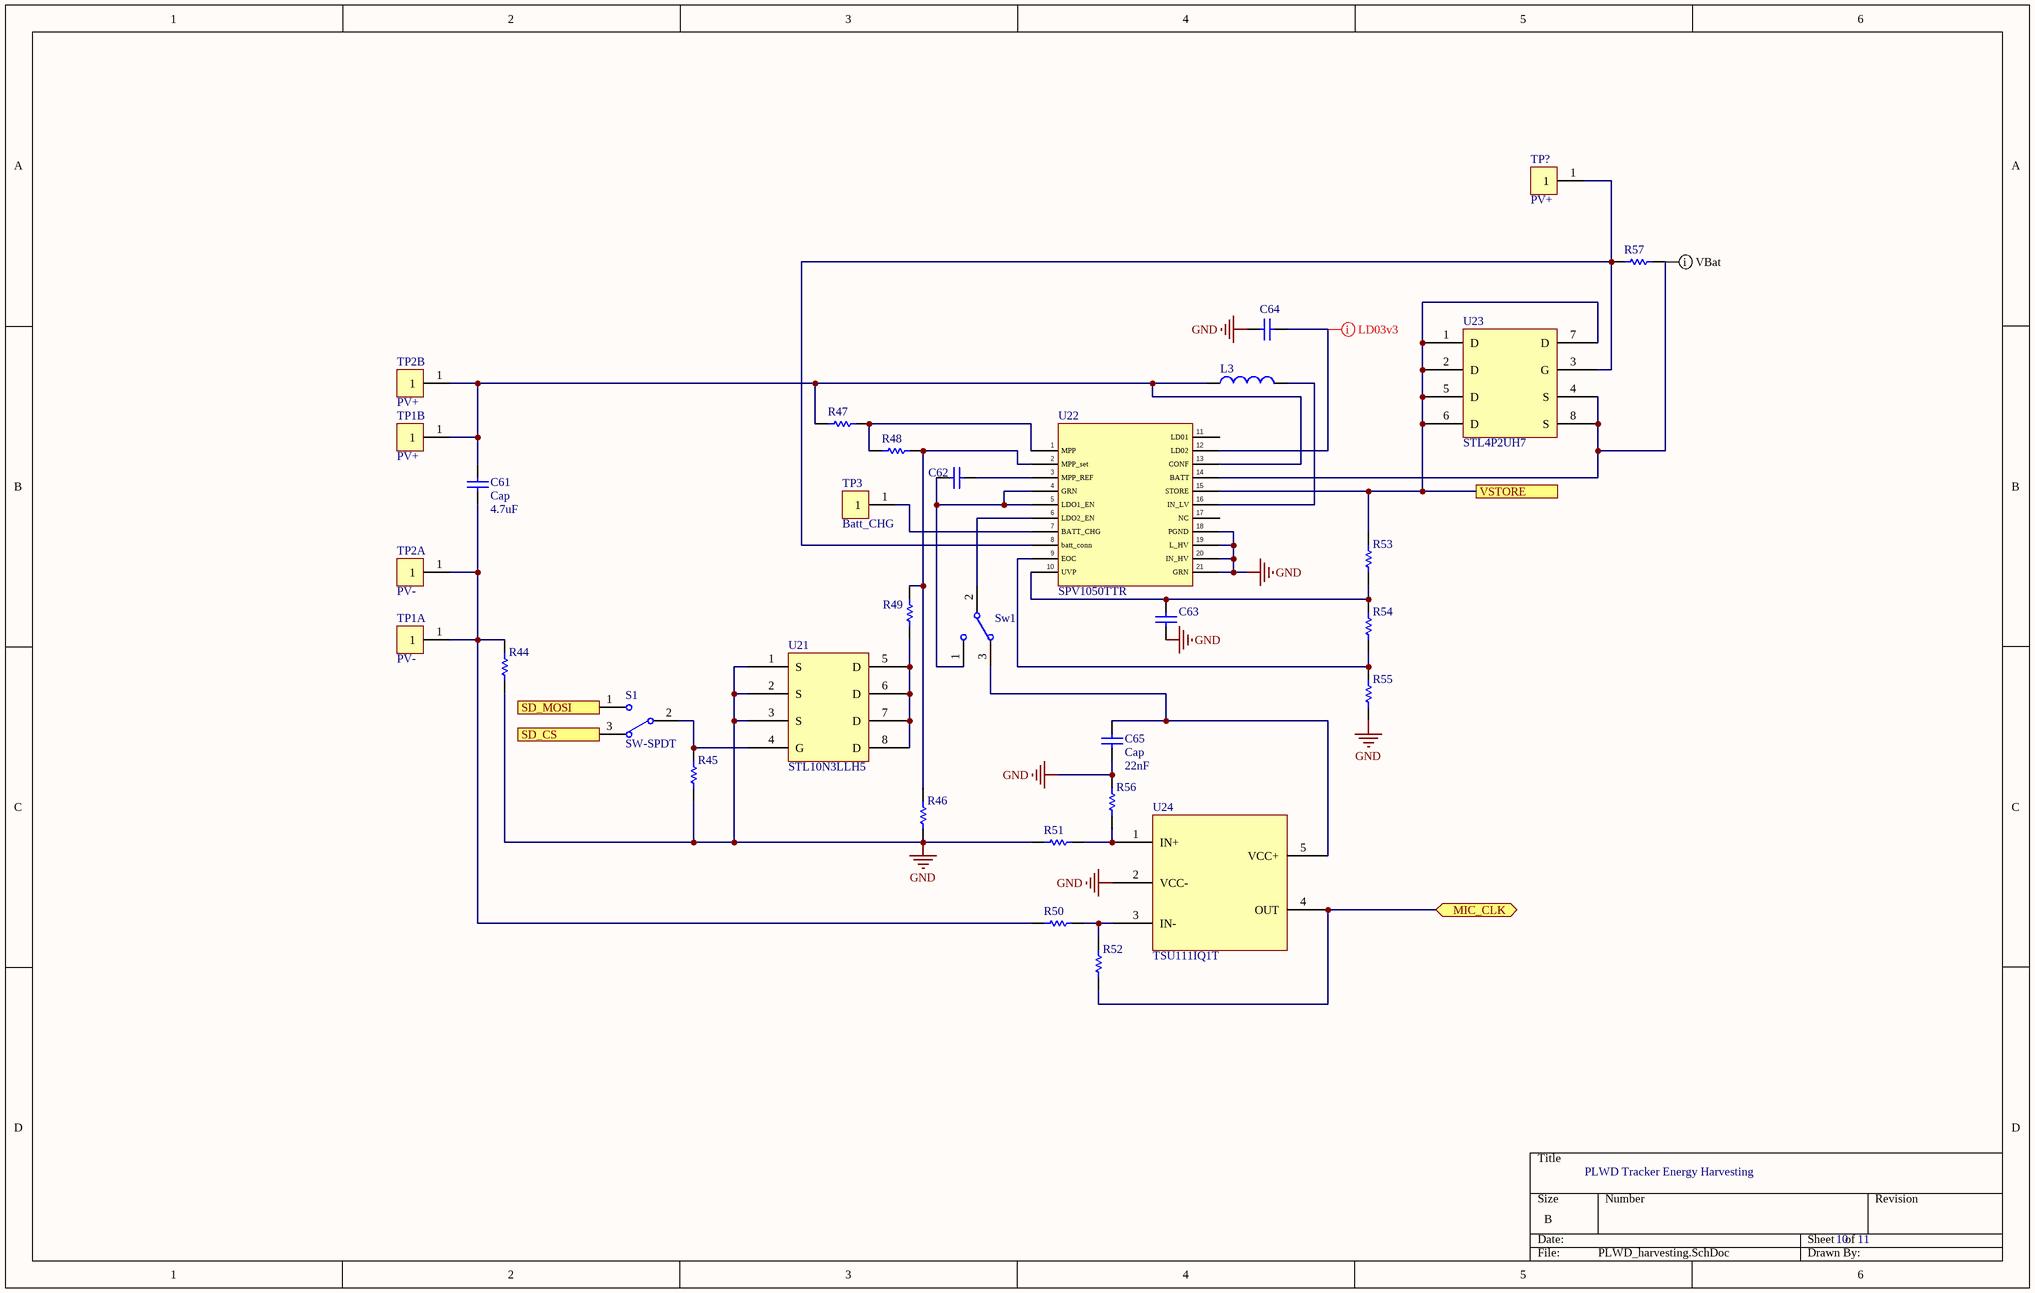
[diagram p5: PLWD_harvesting.SchDoc]

### Parts
C61  Cap  value 4.7uF  [RAD-0.3]
C62  Cap  [RAD-0.3]  (value not drawn)
C63  Cap  [RAD-0.3]  (value not drawn)
C64  Cap  [RAD-0.3]  (value not drawn)
C65  Cap  value 22nF  [RAD-0.3]
L3  Inductor  [0402-A]  (value not drawn)
R44  Res1  [AXIAL-0.3]  (value not drawn)
R45  Res1  [AXIAL-0.3]  (value not drawn)
R46  Res1  [AXIAL-0.3]  (value not drawn)
R47  Res1  [AXIAL-0.3]  (value not drawn)
R48  Res1  [AXIAL-0.3]  (value not drawn)
R49  Res1  [AXIAL-0.3]  (value not drawn)
R50  Res1  [AXIAL-0.3]  (value not drawn)
R51  Res1  [AXIAL-0.3]  (value not drawn)
R52  Res1  [AXIAL-0.3]  (value not drawn)
R53  Res1  [AXIAL-0.3]  (value not drawn)
R54  Res1  [AXIAL-0.3]  (value not drawn)
R55  Res1  [AXIAL-0.3]  (value not drawn)
R56  Res1  [AXIAL-0.3]  (value not drawn)
R57  Res1  [AXIAL-0.3]  (value not drawn)
S1  SW-SPDT  [TL36WW15050]
Sw1  SW-SPDT  [TL36WW15050]  (value not drawn)
TP1A  PV-
TP1B  PV+
TP2A  PV-
TP2B  PV+
TP3  Batt_CHG
TP?  PV+
U21  STL10N3LLH5
U22  SPV1050TTR
U23  STL4P2UH7
U24  TSU111IQ1T

### Ports
MIC_CLK (bidir), SD_CS (in), SD_MOSI (in), VSTORE

### Nets
GND: C63.2 C64.1 C65.1 R44.2 R45.2 R46.1 R51.1 R55.1 R56.2 U21.1(S) U21.2(S) U21.3(S) U22.18(PGND) U22.19(L_HV) U22.20(IN_HV) U22.21(GRN) U24.2(VCC-)
PA6: S1.1 ; port SD_MOSI
PA7: S1.3 ; port SD_CS
NetC61_1: C61.1 R44.1 R50.1 TP1A.1 TP2A.1
NetC61_2: C61.2 L3.1 R47.1 TP1B.1 TP2B.1 U22.13(CONF)
NetC62_1: C62.1 U22.3(MPP_REF)
NetC62_2: C62.2 Sw1.1 U22.4(GRN) U22.5(LDO1_EN)
NetC63_1: C63.1 R53.1 R54.2 U22.10(UVP)
NetC64_2: C64.2 U22.12(LD02)
NetC65_2: C65.2 Sw1.3 U24.5(VCC+)
NetL3_2: L3.2 U22.16(IN_LV)
NetR8_2: R52.1 U24.4(OUT) ; port MIC_CLK
NetR42_1: R53.2 U22.15(STORE) U23.1(D) U23.2(D) U23.5(D) U23.6(D) U23.7(D) ; port VSTORE
NetR45_1: R45.1 S1.2 U21.4(G)
NetR46_2: R46.2 R48.2 R49.2 U22.2(MPP_set)
NetR47_2: R47.2 R48.1 U22.1(MPP)
NetR49_1: R49.1 U21.5(D) U21.6(D) U21.7(D) U21.8(D)
NetR50_2: R50.2 R52.2 U24.3(IN-)
NetR51_2: R51.2 R56.1 U24.1(IN+)
NetR54_1: R54.1 R55.2 U22.9(EOC)
NetR57_1: R57.1 TP?.1 U22.8(batt_conn) U23.3(G)
NetR57_2: R57.2 U22.14(BATT) U23.4(S) U23.8(S)
NetSw1_2: Sw1.2 U22.6(LDO2_EN)
NetTP3_1: TP3.1 U22.7(BATT_CHG)

Not connected (* = marked no-connect by the designer): U22 11(LD01) 17(NC)

### Layout directives
mark named VBat: NetR57_2
mark named LD03v3: NetC64_2

### Notes on the sheet
- PLWD Tracker Energy Harvesting
- 10
- 11

### Library data of the parts
C61-C65 = Cap: Capacitor; Published: 8-Jun-2000; LatestRevisionDate: 17-Jul-2002; LatestRevisionNote: Re-released for DXP Platform.; PackageReference: RAD-0.3; Publisher: Altium Limited; PackageDescription: Radial Cap, Thru-Hole; 2 Leads; 0.3 in Pin Spacing
L3 = Inductor: Code_IEC: 1005; Value: 122uH; Published: 8-Jun-2000; LatestRevisionDate: 29-May-2009; LatestRevisionNote: IPC-7351 Footprint Added.; PackageReference: 0402-A; Publisher: Altium Limited; PackageDescription: Chip Inductor; Code_JEITA: 0402
R44 R45 R47 = Res1: Resistor; Value: 261; Published: 8-Jun-2000; LatestRevisionDate: 17-Jul-2002; LatestRevisionNote: Re-released for DXP Platform.; PackageReference: AXIAL-0.3; Publisher: Altium Limited; PackageDescription: Axial Device, Thru-Hole; 2 Leads; 0.3 in Pin Spacing
R46 R49 R51 R53-R55 R57 = Res1: Resistor; Value: 283.3k; Published: 8-Jun-2000; LatestRevisionDate: 17-Jul-2002; LatestRevisionNote: Re-released for DXP Platform.; PackageReference: AXIAL-0.3; Publisher: Altium Limited; PackageDescription: Axial Device, Thru-Hole; 2 Leads; 0.3 in Pin Spacing
R48 = Res1: Resistor; Value: 120; Published: 8-Jun-2000; LatestRevisionDate: 17-Jul-2002; LatestRevisionNote: Re-released for DXP Platform.; PackageReference: AXIAL-0.3; Publisher: Altium Limited; PackageDescription: Axial Device, Thru-Hole; 2 Leads; 0.3 in Pin Spacing
R50 R52 = Res1: Resistor; Value: 273.3k; Published: 8-Jun-2000; LatestRevisionDate: 17-Jul-2002; LatestRevisionNote: Re-released for DXP Platform.; PackageReference: AXIAL-0.3; Publisher: Altium Limited; PackageDescription: Axial Device, Thru-Hole; 2 Leads; 0.3 in Pin Spacing
R56 = Res1: Resistor; Value: 330k; Published: 8-Jun-2000; LatestRevisionDate: 17-Jul-2002; LatestRevisionNote: Re-released for DXP Platform.; PackageReference: AXIAL-0.3; Publisher: Altium Limited; PackageDescription: Axial Device, Thru-Hole; 2 Leads; 0.3 in Pin Spacing
S1 Sw1 = SW-SPDT: SPDT Subminiature Toggle Switch, Right Angle Mounting, Vertical Actuation; Published: 24-Mar-1999; LatestRevisionDate: 17-Dec-2003; LatestRevisionNote: Schematic revised, PCB Footprint replaced.; DatasheetVersion: 05-Dec-2000; PackageReference: TL36WW15050; Publisher: Altium Limited; PackageDescription: Switch; 4 Leads; ComponentLink1Description: Manufacturer Link; ComponentLink1URL: http://www.apem.com
TP1A TP2A = PV- Connector
TP1B TP2B TP3 TP? = PV Connector
U21 = STL10N3LLH5: N-channel 30 V, 0.015 Ohm, 9 A, PowerFLAT(TM) 3.3x3.3 STripFET(TM) V Power MOSFET; Manufacturer: STMicroelectronics; Rise Time: 4.2ns; Rds On Max: 19mR; Input Capacitance: 900pF; Continuous Drain Current (ID): 9A; Drain to Source Breakdown Voltage: 30V; Power Dissipation: 50W; Turn-Off Delay Time: 21ns; Fall Time: 3.5ns; Gate to Source Voltage (Vgs): 22V; Turn-On Delay Time: 4ns; Element Configuration: Single; Nominal Vgs: 1V; On-State Resistance: 11.7R; Supplier 1: Mouser; Manufacturer Part Number: STL10N3LLH5; RoHS: Yes; Category: MOSFETs; Stock 1: 399; Pricing 1: 1=0.91000, 10=0.81400, 50=0.81400, 100=0.63500, 1000=0.41400, 10000=0.40100 (USD); Mount: Surface Mount; Number of Pins: 8; Min Operating Temperature: -55°C; Max Operating Temperature: 150°C; Packaging: Tape and Reel; Package Quantity: 1; Drain to Source Resistance: 19mR; Drain to Source Voltage (Vdss): 30V; Max Power Dissipation: 50W; Polarity: N-CHANNEL; Series: STripFET™ V; Threshold Voltage: 1V; Drain-source On Resistance-Max: 11.7R; Radiation Hardening: No; RoHS Compliant: Yes; REACH SVHC: No SVHC; Lead Free: Lead Free; ComponentLink1URL: https://datasheet.ciiva.com/4440/dm00035877-100296-4440615.pdf?src-supplier=Mouser; ComponentLink1Description: https://datasheet.ciiva.com/4440/dm00035877-100296-4440615.pdf?src-supplier=Mouser; ComponentLink2URL: https://datasheet.ciiva.com/16217/dm00035877-16217685.pdf?src-supplier=Future+Electronics; ComponentLink2Description: https://datasheet.ciiva.com/16217/dm00035877-16217685.pdf?src-supplier=Future+Electronics; ComponentLink3URL: https://datasheet.ciiva.com/22692/1722909-22692225.pdf?src-supplier=Element14; ComponentLink3Description: https://datasheet.ciiva.com/22692/1722909-22692225.pdf?src-supplier=Element14; ComponentLink4URL: https://datasheet.ciiva.com/938/dm00035877-938683.pdf?src-supplier=Digi-Key; ComponentLink4Description: https://datasheet.ciiva.com/938/dm00035877-938683.pdf?src-supplier=Digi-Key; ComponentLink5URL: https://datasheet.ciiva.com/6368/dm00035877-6368525.pdf?src-supplier=Digi-Key; ComponentLink5Description: https://datasheet.ciiva.com/6368/dm00035877-6368525.pdf?src-supplier=Digi-Key
U22 = SPV1050TTR: Ultra low power energy harvester and battery charger with embedded MPPT and LDOs; Manufacturer: STMicroelectronics; Max Supply Voltage: 18V; Max Charge Current: 70mA; Battery Pack Voltage: 5.3V; Supplier 1: Digi-Key; Manufacturer Part Number: SPV1050TTR; RoHS: Yes; Category: Battery Management; Pricing 1: 1=3.91000, 10=3.51000, 25=3.31880, 100=2.87620, 250=2.72872, 500=2.44848, 1000=2.43512 (USD); Number of Pins: 20; Min Operating Temperature: -40°C; Max Operating Temperature: 85°C; Packaging: Tape and Reel; RoHS Compliant: Yes; ComponentLink1URL: http://www.farnell.com/datasheets/2291180.pdf?src-supplier=Farnell; ComponentLink1Description: http://www.farnell.com/datasheets/2291180.pdf?src-supplier=Farnell; ComponentLink2URL: http://www.mouser.com/ds/2/389/spv1050-974147.pdf?src-supplier=Mouser; ComponentLink2Description: http://www.mouser.com/ds/2/389/spv1050-974147.pdf?src-supplier=Mouser; ComponentLink3URL: http://www.st.com/content/ccc/resource/technical/document/datasheet/3e/91/0f/7c/32/3e/46/dd/DM00100984.pdf/files/DM00100984.pdf/jcr:content/translations/en.DM00100984.pdf?src-supplier=Digi-Key; ComponentLink3Description: http://www.st.com/content/ccc/resource/technical/document/datasheet/3e/91/0f/7c/32/3e/46/dd/DM00100984.pdf/files/DM00100984.pdf/jcr:content/translations/en.DM00100984.pdf?src-supplier=Digi-Key; ComponentLink4URL: http://www.st.com/web/en/resource/technical/document/datasheet/DM00100984.pdf?src-supplier=Avnet; ComponentLink4Description: http://www.st.com/web/en/resource/technical/document/datasheet/DM00100984.pdf?src-supplier=Avnet; ComponentLink5URL: http://www.farnell.com/datasheets/2291180.pdf?src-supplier=Newark; ComponentLink5Description: http://www.farnell.com/datasheets/2291180.pdf?src-supplier=Newark; Supplier Part Number 1: 497-15978-1-ND
U23 = STL4P2UH7: P-channel 20 V, 0.087 Ohm typ., 4 A STripFET H7 Power MOSFET in a PowerFLAT 2x2 package; Manufacturer: STMicroelectronics; Drain to Source Voltage (Vdss): 20V; Continuous Drain Current (ID): 4A; Rds On Max: 100mR; Input Capacitance: 510pF; Max Power Dissipation: 2.4W; Number of Elements: 1; Gate to Source Voltage (Vgs): 8V; Element Configuration: Single; Fall Time: 19ns; Rise Time: 21ns; Turn-Off Delay Time: 40ns; Turn-On Delay Time: 9ns; Supplier 1: Digi-Key; Manufacturer Part Number: STL4P2UH7; RoHS: Yes; Category: MOSFETs; Stock 1: 4; Pricing 1: 1=0.46000 (USD); Mount: Surface Mount; Number of Pins: 6; Min Operating Temperature: -55°C; Max Operating Temperature: 150°C; Packaging: Tape and Reel; Power Dissipation: 2.4W; Number of Channels: 1; Drain to Source Breakdown Voltage: 20V; Drain to Source Resistance: 100mR; Package Quantity: 3000; Lead Free: Lead Free; ComponentLink1URL: http://components.arrow.com/part/dataview/66338135S1070583N9185?src-supplier=Arrow+Electronics; ComponentLink1Description: http://components.arrow.com/part/dataview/66338135S1070583N9185?src-supplier=Arrow+Electronics; ComponentLink2URL: http://www.mouser.com/ds/2/389/stl4p2uh7-956091.pdf?src-supplier=Mouser; ComponentLink2Description: http://www.mouser.com/ds/2/389/stl4p2uh7-956091.pdf?src-supplier=Mouser; ComponentLink3URL: http://www.st.com/content/ccc/resource/technical/document/datasheet/group3/56/f4/8b/71/b1/01/42/91/DM00091043/files/DM00091043.pdf/jcr:content/translations/en.DM00091043.pdf?src-supplier=Digi-Key; ComponentLink3Description: http://www.st.com/content/ccc/resource/technical/document/datasheet/group3/56/f4/8b/71/b1/01/42/91/DM00091043/files/DM00091043.pdf/jcr:content/translations/en.DM00091043.pdf?src-supplier=Digi-Key; ComponentLink4URL: http://www.st.com/st-web-ui/static/active/en/resource/technical/document/datasheet/DM00091043.pdf?src-supplier=Avnet; ComponentLink4Description: http://www.st.com/st-web-ui/static/active/en/resource/technical/document/datasheet/DM00091043.pdf?src-supplier=Avnet
U24 = TSU111IQ1T: Nanopower (900 nA) high accuracy (150 uV) 5V CMOS Op-Amp, -40 to 85°C, MLPD-6, Tape and Reel; Manufacturer: STMicroelectronics; Number of Circuits: 1; Slew Rate: 0.0027V/µs; Gain Bandwidth Product: 11.5kHz; Input Bias Current: 10pA; Input Offset Voltage (Vos): 150uV; Operating Supply Current: 950nA; Output Current per Channel: 45mA; Supplier 1: Digi-Key; Manufacturer Part Number: TSU111IQ1T; RoHS: Yes; Category: Amplifiers - Op Amps, Buffer, Instrumentation; Stock 1: 1685; Pricing 1: 1=1.91000, 10=1.71600, 25=1.61880, 100=1.37930, 250=1.29512, 500=1.13322, 1000=1.06908 (USD); Mount: Surface Mount; Case/Package: DFN; Number of Pins: 6; Min Operating Temperature: -40°C; Max Operating Temperature: 85°C; Packaging: Cut Tape; RoHS Compliant: Yes; ComponentLink1URL: http://www.st.com/content/ccc/resource/technical/document/datasheet/group3/30/c9/50/18/06/1a/44/8d/DM00329336/files/DM00329336.pdf/jcr:content/translations/en.DM00329336.pdf?src-supplier=Digi-Key; ComponentLink1Description: http://www.st.com/content/ccc/resource/technical/document/datasheet/group3/30/c9/50/18/06/1a/44/8d/DM00329336/files/DM00329336.pdf/jcr:content/translations/en.DM00329336.pdf?src-supplier=Digi-Key

## Sheet PLWD_GNSS_1.SchDoc
size A3; SheetNumber: 5; SheetTotal: 11
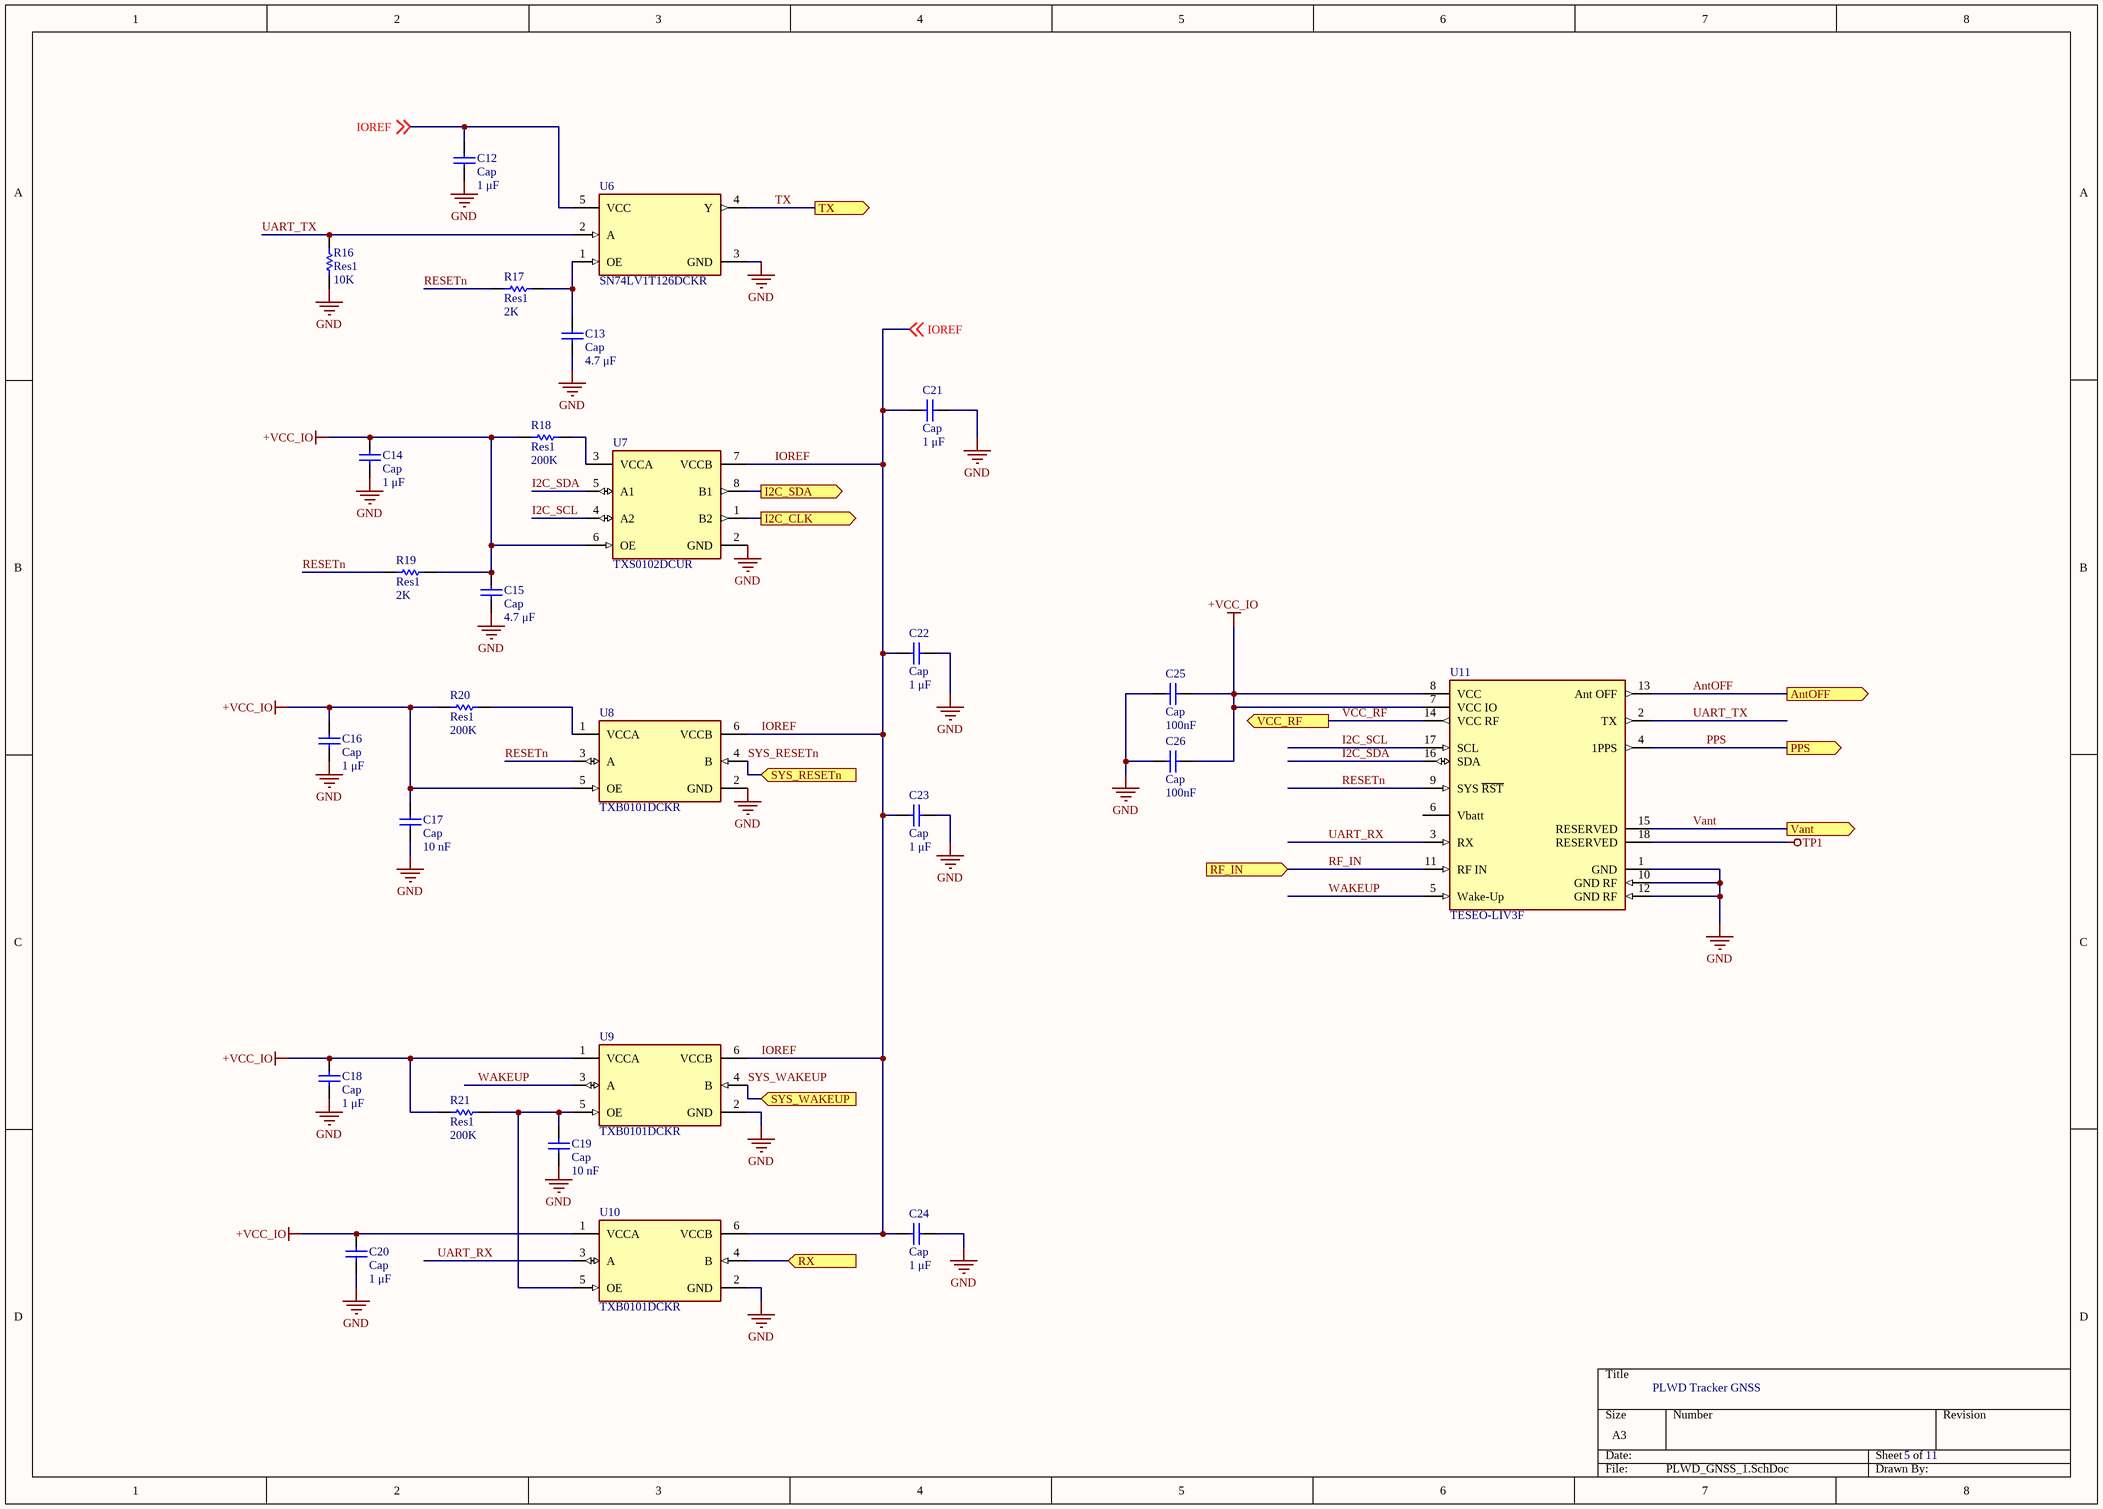
[diagram p6: PLWD_GNSS_1.SchDoc]

### Parts
C12  Cap  value 1 μF  [RAD-0.3]
C13  Cap  value 4.7 μF  [RAD-0.3]
C14  Cap  value 1 μF  [RAD-0.3]
C15  Cap  value 4.7 μF  [RAD-0.3]
C16  Cap  value 1 μF  [RAD-0.3]
C17  Cap  value 10 nF  [RAD-0.3]
C18  Cap  value 1 μF  [RAD-0.3]
C19  Cap  value 10 nF  [RAD-0.3]
C20  Cap  value 1 μF  [RAD-0.3]
C21  Cap  value 1 μF  [RAD-0.3]
C22  Cap  value 1 μF  [RAD-0.3]
C23  Cap  value 1 μF  [RAD-0.3]
C24  Cap  value 1 μF  [RAD-0.3]
C25  Cap  value 100nF  [RAD-0.3]
C26  Cap  value 100nF  [RAD-0.3]
R16  Res1  value 10K  [AXIAL-0.3]
R17  Res1  value 2K  [AXIAL-0.3]
R18  Res1  value 200K  [AXIAL-0.3]
R19  Res1  value 2K  [AXIAL-0.3]
R20  Res1  value 200K  [AXIAL-0.3]
R21  Res1  value 200K  [AXIAL-0.3]
U6  SN74LV1T126DCKR  [FP-DCK0005A-IPC_A]
U7  TXS0102DCUR  [FP-DCU0008A-MFG]
U8  TXB0101DCKR  [FP-DCK0006A-MFG]
U9  TXB0101DCKR  [FP-DCK0006A-MFG]
U10  TXB0101DCKR  [FP-DCK0006A-MFG]
U11  TESEO-LIV3F  [FP-LCC-18-MFG]

### Ports
AntOFF (out), I2C_CLK (out), I2C_SDA (out), PPS (out), RF_IN (in), RX (in), SYS_RESETn (in), SYS_WAKEUP (in), TX (out), Vant (out), VCC_RF (out)

### Nets
+VCC_IO: C14.2 C15.2 C16.2 C17.2 C18.2 C20.2 C25.2 C26.2 R18.1 R19.2 R20.1 R21.1 U7.6(OE) U8.5(OE) U9.1(VCCA) U10.1(VCCA) U11.7(VCC_IO) U11.8(VCC)
GND: C12.1 C13.1 C14.1 C15.1 C16.1 C17.1 C18.1 C19.1 C20.1 C21.2 C22.2 C23.2 C24.2 C25.1 C26.1 R16.1 U6.3(GND) U7.2(GND) U8.2(GND) U9.2(GND) U10.2(GND) U11.1(GND) U11.10(GND_RF) U11.12(GND_RF)
TP1: U11.18(RESERVED)
AntOFF: U11.13(Ant_OFF) ; port AntOFF
I2C_SCL: U7.4(A2) U11.17(SCL)
I2C_SDA: U7.5(A1) U11.16(SDA)
IOREF: C12.2 C21.1 C22.1 C23.1 C24.1 U6.5(VCC) U7.7(VCCB) U8.6(VCCB) U9.6(VCCB) U10.6(VCCB) ; off-sheet IOREF
PPS: U11.4(1PPS) ; port PPS
RESETn: R17.1 R19.1 U8.3(A) U11.9(SYS_~{RST})
RF_IN: U11.11(RF_IN) ; port RF_IN  [project net Ant_In]
SYS_RESETn: U8.4(B) ; port SYS_RESETn
SYS_WAKEUP: U9.4(B) ; port SYS_WAKEUP
TX: U6.4(Y) ; port TX
UART_RX: U10.3(A) U11.3(RX)
UART_TX: R16.2 U6.2(A) U11.2(TX)
Vant: U11.15(RESERVED) ; port Vant
VCC_RF: U11.14(VCC_RF) ; port VCC_RF
WAKEUP: U9.3(A) U11.5(Wake-Up)
NetC13_2: C13.2 R17.2 U6.1(OE)
NetC19_2: C19.2 R21.2 U9.5(OE) U10.5(OE)
NetR18_2: R18.2 U7.3(VCCA)
NetR20_2: R20.2 U8.1(VCCA)
NetU1_36: U10.4(B) ; port RX
NetU1_139: U7.1(B2) ; port I2C_CLK
NetU1_140: U7.8(B1) ; port I2C_SDA

Not connected (* = marked no-connect by the designer): U11 6(Vbatt)

### Notes on the sheet
- PLWD Tracker GNSS
- 5
- 11

### Library data of the parts
C12-C26 = Cap: Capacitor; Published: 8-Jun-2000; LatestRevisionDate: 17-Jul-2002; LatestRevisionNote: Re-released for DXP Platform.; PackageReference: RAD-0.3; Publisher: Altium Limited; PackageDescription: Radial Cap, Thru-Hole; 2 Leads; 0.3 in Pin Spacing
R16-R21 = Res1: Resistor; Published: 8-Jun-2000; LatestRevisionDate: 17-Jul-2002; LatestRevisionNote: Re-released for DXP Platform.; PackageReference: AXIAL-0.3; Publisher: Altium Limited; PackageDescription: Axial Device, Thru-Hole; 2 Leads; 0.3 in Pin Spacing
U6 = CMP-0859-00355-4: IC BUF NON-INVERT 5.5V SC70-5; Number of Inputs: 1; Operating Supply Current: 8mA; Propagation Delay: 16ns; High Level Output Current: -8mA; Quiescent Current: 1uA; Logic Function: Buffer; Min Supply Voltage: 1.6V; Polarity: Non-Inverting; Number of Pins: 5; Package Quantity: 3000; REACH SVHC: No SVHC; Case/Package: SC; Radiation Hardening: No; Lead Free: Lead Free; Number of Elements: 1; Number of Input Lines: 1; Number of Bits: 1; Max Operating Temperature: 125°C; Mount: Surface Mount; Number of Bits per Element: 1; Low Level Output Current: 8mA; RoHS Compliant: Yes; Number of Output Lines: 1; Weight: 0.000215oz; Number of Outputs: 1; Number of Channels: 1; Min Operating Temperature: -40°C; Contact Plating: Gold; Packaging: Tape and Reel; Max Supply Voltage: 5.5V
U7 = CMP-0859-00001-2: IC TRNSLTR BIDIRECTIONAL US8; Manufacturer: Texas Instruments; Number Of Circuits: 1; Number Of Inputs: 2; Data Rate: 24Mbits/s; Max Junction Temp: +150°C; V A Min: 1.65V; Standoff Height: 0mm; Logic Function Desc: Bidirectional Voltage-Level Translator; Max Supply Voltage: 5.5V; V A Max: 3.6V; Nominal Supply Current: 1-14.4uA; V B Min: 2.3V; Temperature: -40°C to +85°C; Temperature Range Low: -40°C; Height: 0.9mm; Device Class L1: Integrated Circuits (ICs); RoHS: TRUE; Min Supply Voltage: 1.65V; Digikey Description: IC TRNSLTR BIDIRECTIONAL US8; ComponentLink2Description: Datasheet; Octopart: https://octopart.com/txs0102dcur-texas+instruments-5414308; Temperature Range High: +85°C; Device Class L2: Logic ICs; Category: IC; Ambient Temperature Range High: +85°C; Automotive: No; Manufacturer Part Number: TXS0102DCUR; Device Class L3: Voltage Level Shifters; Number Of Outputs: 2; Ambient Temperature Range Low: -40°C; Lead Free: Yes; ComponentLink2URL: http://www.ti.com/lit/ds/symlink/txs0102.pdf; V B Max: 5.5V; Package: DCU0008A; Mouser Description: Translation - Voltage Levels 2-Bit Bi-Directional Voltage-Level-Trans
U8-U10 = CMP-04899-000110-1: IC TRNSLTR BIDIRECTIONAL SC70-6; Number of Bits: 1; Low Level Output Current: 20uA; Data Rate: 100Mbps; Logic Function: Translator; Min Supply Voltage: 1.2V; Turn-On Delay Time: 7.4ns; Propagation Delay: 31ns; High Level Output Current: -20uA; Max Supply Voltage: 5.5V; Series: -; Height: 1mm; Packaging: Tape and Reel; RoHS Compliant: Yes; Width: 1.4mm; Package Quantity: 1; Mount: Surface Mount; Case/Package: SC; Length: 2.15mm; Number of Pins: 6; Max Operating Temperature: 85°C; Contact Plating: Gold; Min Operating Temperature: -40°C; Radiation Hardening: No; Lead Free: Lead Free; Number of Inputs: 1; Number of Channels: 1; REACH SVHC: No SVHC
U11 = CMP-12160-000003-1: RF RCVR GNSS/GPS 1.575GHZ 18LCC; Manufacturer: STMicroelectronics; Min Supply Voltage: 2.1V; Max Supply Voltage: 4.3V; Interface: I2C,UART; Sensitivity: -163dBm; Max Frequency: 1575.42MHz; ComponentLink2Description: Datasheet; Package: LCC-18; RoHS: TRUE; Temperature Range Low: -40°C; Manufacturer Part Number: TESEO-LIV3F; Ambient Temperature Range Low: -40°C; ComponentLink2URL: https://www.st.com/resource/en/datasheet/teseo-liv3f.pdf; Octopart: https://octopart.com/teseo-liv3f-stmicroelectronics-84762432; Device Class L1: Integrated Circuits (ICs); Mouser Description: Rf Receiver, 1.57542Ghz, -40 To 85Deg C; Digikey Description: RF RCVR GNSS/GPS 1.575GHZ 18LCC; Device Class L3: RF Receivers; Ambient Temperature Range High: +85°C; Temperature Range High: +85°C; Lead Free: Yes; Height: 2.33mm; Automotive: No; Category: UNK; Temperature: -40°C to +85°C; Device Class L2: RF Semiconductors and Devices

## Sheet PLWD_Battery_Charger.SchDoc
size A3; SheetNumber: 9; SheetTotal: 11
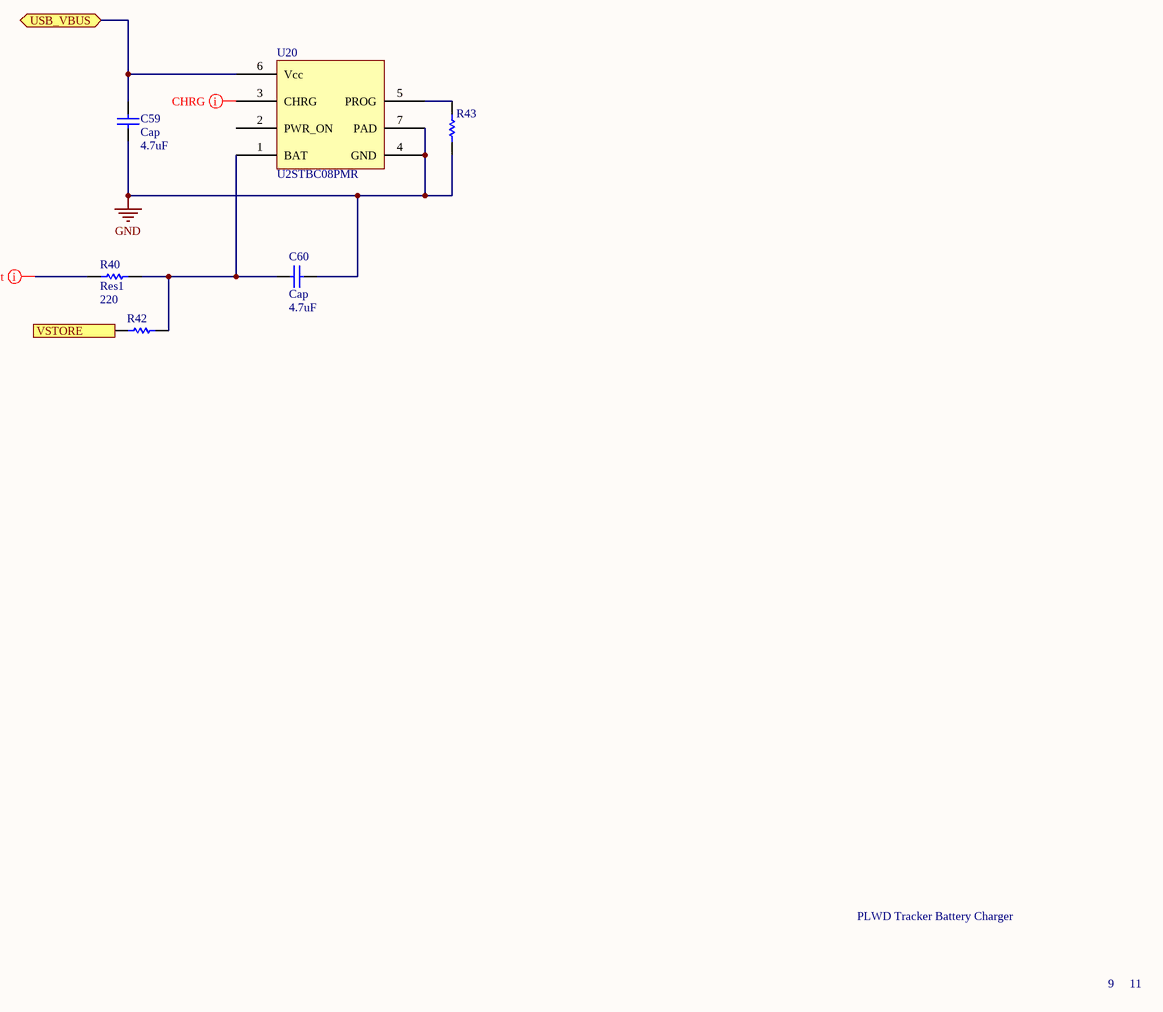
[diagram p7: PLWD_Battery_Charger.SchDoc]

### Parts
C59  Cap  value 4.7uF  [RAD-0.3]
C60  Cap  value 4.7uF  [RAD-0.3]
R40  Res1  value 220  [AXIAL-0.3]
R42  Res1  [AXIAL-0.3]  (value not drawn)
R43  Res1  [AXIAL-0.3]  (value not drawn)
U20  U2STBC08PMR

### Ports
USB_VBUS (bidir), VSTORE

### Nets
GND: C59.1 C60.1 R43.2 U20.4(GND) U20.7(PAD)
PA9: C59.2 U20.6(Vcc) ; port USB_VBUS
NetC60_2: C60.2 R40.2 R42.2 U20.1(BAT)
NetR42_1: R42.1 ; port VSTORE
NetR43_1: R43.1 U20.5(PROG)

Not connected (* = marked no-connect by the designer): R40 1; U20 2(PWR_ON) 3(CHRG)

### Layout directives
mark named CHRG: NetU20_3
mark named VBat: NetR40_1

### Notes on the sheet
- PLWD Tracker Battery Charger
- 9
- 11

### Library data of the parts
C59 C60 = Cap: Capacitor; Published: 8-Jun-2000; LatestRevisionDate: 17-Jul-2002; LatestRevisionNote: Re-released for DXP Platform.; PackageReference: RAD-0.3; Publisher: Altium Limited; PackageDescription: Radial Cap, Thru-Hole; 2 Leads; 0.3 in Pin Spacing
R40 = Res1: Resistor; Published: 8-Jun-2000; LatestRevisionDate: 17-Jul-2002; LatestRevisionNote: Re-released for DXP Platform.; PackageReference: AXIAL-0.3; Publisher: Altium Limited; PackageDescription: Axial Device, Thru-Hole; 2 Leads; 0.3 in Pin Spacing
R42 R43 = Res1: Resistor; Value: 261; Published: 8-Jun-2000; LatestRevisionDate: 17-Jul-2002; LatestRevisionNote: Re-released for DXP Platform.; PackageReference: AXIAL-0.3; Publisher: Altium Limited; PackageDescription: Axial Device, Thru-Hole; 2 Leads; 0.3 in Pin Spacing